# Altium project PCB_VideoMux.PrjPCB
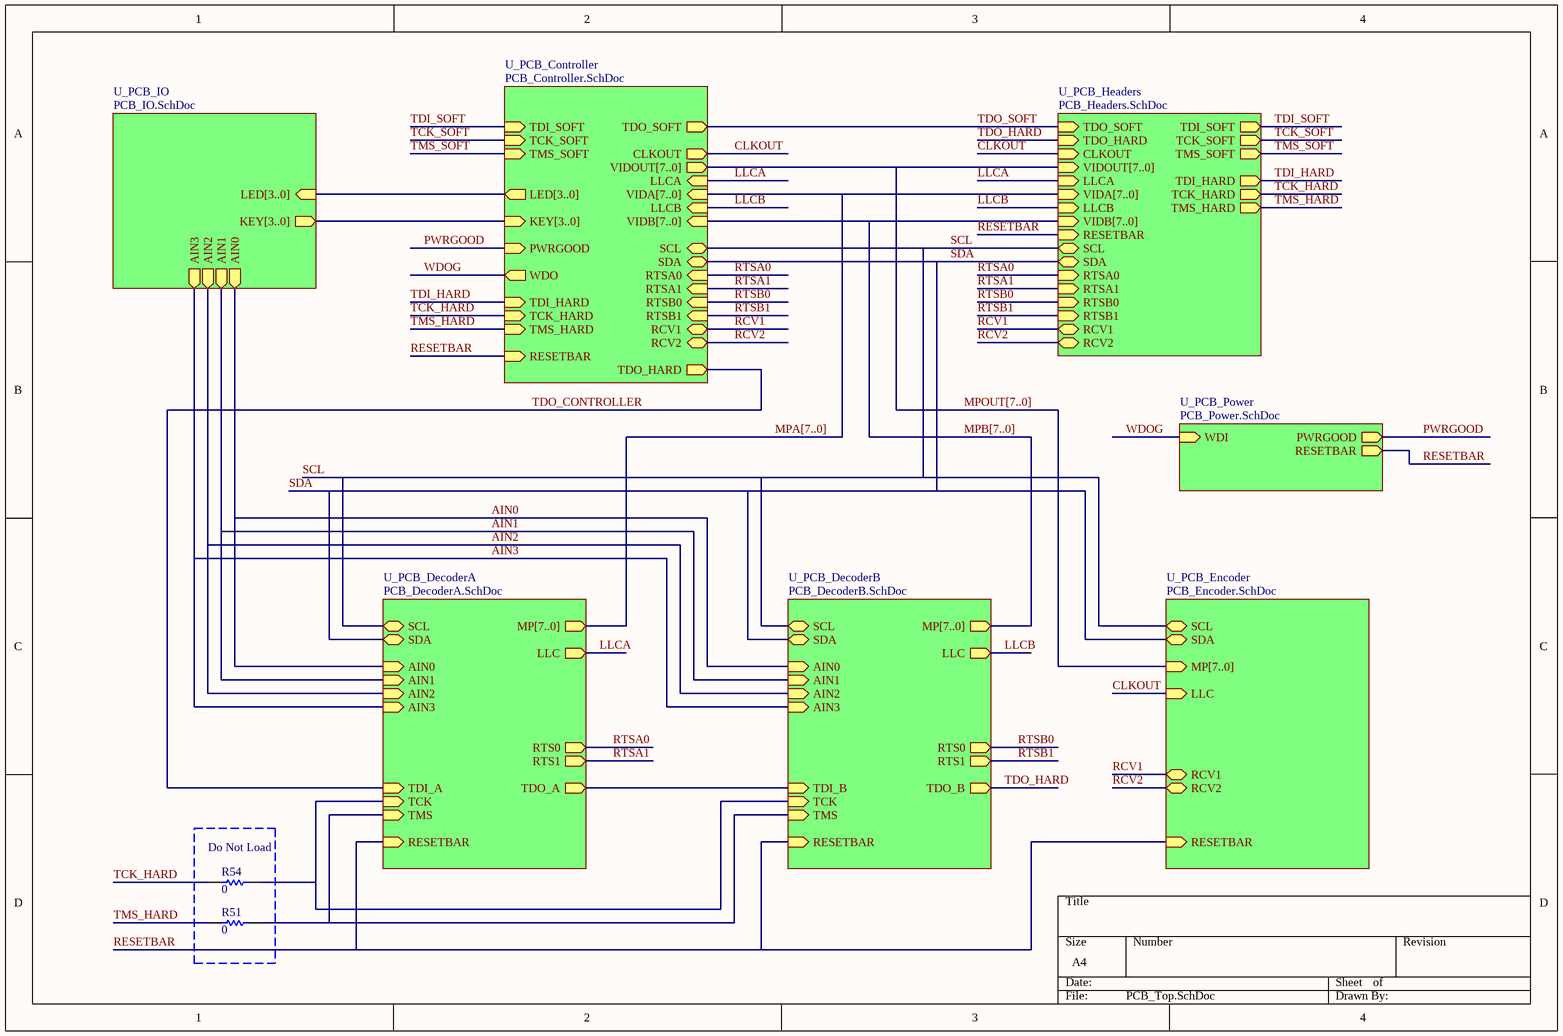
[diagram p0: PCB_Top.SchDoc]
8 sheets, 243 parts. Net scope: hierarchical (ports join the sheet entries above them; power ports are global).
Board file: VideoMuxBoard.PcbDoc
Sheets:
  PCB_Top.SchDoc
    U_PCB_DecoderA = PCB_DecoderA.SchDoc
    U_PCB_DecoderB = PCB_DecoderB.SchDoc
    U_PCB_Headers = PCB_Headers.SchDoc
    U_PCB_Encoder = PCB_Encoder.SchDoc
    U_PCB_IO = PCB_IO.SchDoc
    U_PCB_Controller = PCB_Controller.SchDoc
    U_PCB_Power = PCB_Power.SchDoc

## Sheet PCB_Top.SchDoc
size A4; DocumentNumber: 1; SheetNumber: 1; SheetTotal: 8

### Parts
R51  0  [CC2012-0805]
R54  0  [CC2012-0805]

### Blocks framed on the sheet
Do Not Load: R51 R54

### Sub-sheets
U_PCB_Controller = PCB_Controller.SchDoc: TMS_HARD (in), TMS_SOFT (in), TCK_SOFT (in), TDI_SOFT (in), TDI_HARD (in), TCK_HARD (in), TDO_HARD (out), TDO_SOFT (out), CLKOUT (out), VIDOUT[7..0] (out), LLCA (in), LLCB (in), VIDA[7..0] (in), VIDB[7..0] (in), RESETBAR (in), SCL (bidir), SDA (bidir), RTSA0 (in), RTSA1 (in), RTSB0 (in), RTSB1 (in), RCV1 (bidir), RCV2 (bidir), KEY[3..0] (in), LED[3..0] (out), PWRGOOD (in), WDO (out)
U_PCB_DecoderA = PCB_DecoderA.SchDoc: SCL (bidir), SDA (bidir), TDI_A (in), TCK (in), TMS (in), TDO_A (out), AIN0 (in), AIN1 (in), AIN2 (in), AIN3 (in), MP[7..0] (out), LLC (out), RESETBAR (in), RTS0 (out), RTS1 (out)
U_PCB_DecoderB = PCB_DecoderB.SchDoc: SCL (bidir), SDA (bidir), TDI_B (in), TCK (in), TMS (in), TDO_B (out), AIN0 (in), AIN1 (in), AIN2 (in), AIN3 (in), MP[7..0] (out), LLC (out), RESETBAR (in), RTS0 (out), RTS1 (out)
U_PCB_Encoder = PCB_Encoder.SchDoc: MP[7..0] (in), LLC (in), SCL (bidir), SDA (bidir), RESETBAR (in), RCV1 (bidir), RCV2 (bidir)
U_PCB_Headers = PCB_Headers.SchDoc: TMS_HARD (out), TMS_SOFT (out), TCK_SOFT (out), TDI_SOFT (out), TDI_HARD (out), TCK_HARD (out), TDO_HARD (in), TDO_SOFT (in), CLKOUT (in), VIDOUT[7..0] (in), LLCA (in), LLCB (in), VIDA[7..0] (in), VIDB[7..0] (in), RESETBAR (in), SCL (bidir), SDA (bidir), RTSA0 (in), RTSA1 (in), RTSB0 (in), RTSB1 (in), RCV1 (bidir), RCV2 (bidir)
U_PCB_IO = PCB_IO.SchDoc: AIN0 (out), AIN1 (out), AIN2 (out), AIN3 (out), KEY[3..0] (out), LED[3..0] (in)
U_PCB_Power = PCB_Power.SchDoc: PWRGOOD (out), RESETBAR (out), WDI (in)

### Nets
AIN0: sheet U_PCB_DecoderA/AIN0, sheet U_PCB_DecoderB/AIN0, sheet U_PCB_IO/AIN0
AIN1: sheet U_PCB_DecoderA/AIN1, sheet U_PCB_DecoderB/AIN1, sheet U_PCB_IO/AIN1
AIN2: sheet U_PCB_DecoderA/AIN2, sheet U_PCB_DecoderB/AIN2, sheet U_PCB_IO/AIN2
AIN3: sheet U_PCB_DecoderA/AIN3, sheet U_PCB_DecoderB/AIN3, sheet U_PCB_IO/AIN3
CLKOUT: sheet U_PCB_Headers/CLKOUT, sheet U_PCB_Encoder/LLC, sheet U_PCB_Controller/CLKOUT
LLCA: sheet U_PCB_DecoderA/LLC, sheet U_PCB_Headers/LLCA, sheet U_PCB_Controller/LLCA
LLCB: sheet U_PCB_DecoderB/LLC, sheet U_PCB_Headers/LLCB, sheet U_PCB_Controller/LLCB
PWRGOOD: sheet U_PCB_Controller/PWRGOOD, sheet U_PCB_Power/PWRGOOD
RCV1: sheet U_PCB_Headers/RCV1, sheet U_PCB_Encoder/RCV1, sheet U_PCB_Controller/RCV1
RCV2: sheet U_PCB_Headers/RCV2, sheet U_PCB_Encoder/RCV2, sheet U_PCB_Controller/RCV2
RESETBAR: sheet U_PCB_DecoderA/RESETBAR, sheet U_PCB_DecoderB/RESETBAR, sheet U_PCB_Headers/RESETBAR, sheet U_PCB_Encoder/RESETBAR, sheet U_PCB_Controller/RESETBAR, sheet U_PCB_Power/RESETBAR
RTSA0: sheet U_PCB_DecoderA/RTS0, sheet U_PCB_Headers/RTSA0, sheet U_PCB_Controller/RTSA0
RTSA1: sheet U_PCB_DecoderA/RTS1, sheet U_PCB_Headers/RTSA1, sheet U_PCB_Controller/RTSA1
RTSB0: sheet U_PCB_DecoderB/RTS0, sheet U_PCB_Headers/RTSB0, sheet U_PCB_Controller/RTSB0
RTSB1: sheet U_PCB_DecoderB/RTS1, sheet U_PCB_Headers/RTSB1, sheet U_PCB_Controller/RTSB1
SCL: sheet U_PCB_DecoderA/SCL, sheet U_PCB_DecoderB/SCL, sheet U_PCB_Headers/SCL, sheet U_PCB_Encoder/SCL, sheet U_PCB_Controller/SCL
SDA: sheet U_PCB_DecoderA/SDA, sheet U_PCB_DecoderB/SDA, sheet U_PCB_Headers/SDA, sheet U_PCB_Encoder/SDA, sheet U_PCB_Controller/SDA
TCK: R54.2 ; sheet U_PCB_DecoderA/TCK, sheet U_PCB_DecoderB/TCK
TCK_HARD: R54.1 ; sheet U_PCB_Headers/TCK_HARD, sheet U_PCB_Controller/TCK_HARD
TCK_SOFT: sheet U_PCB_Headers/TCK_SOFT, sheet U_PCB_Controller/TCK_SOFT
TDI_B: sheet U_PCB_DecoderA/TDO_A, sheet U_PCB_DecoderB/TDI_B
TDI_HARD: sheet U_PCB_Headers/TDI_HARD, sheet U_PCB_Controller/TDI_HARD
TDI_SOFT: sheet U_PCB_Headers/TDI_SOFT, sheet U_PCB_Controller/TDI_SOFT
TDO_CONTROLLER: sheet U_PCB_DecoderA/TDI_A, sheet U_PCB_Controller/TDO_HARD
TDO_HARD: sheet U_PCB_DecoderB/TDO_B, sheet U_PCB_Headers/TDO_HARD
TDO_SOFT: sheet U_PCB_Headers/TDO_SOFT, sheet U_PCB_Controller/TDO_SOFT
TMS: R51.2 ; sheet U_PCB_DecoderA/TMS, sheet U_PCB_DecoderB/TMS
TMS_HARD: R51.1 ; sheet U_PCB_Headers/TMS_HARD, sheet U_PCB_Controller/TMS_HARD
TMS_SOFT: sheet U_PCB_Headers/TMS_SOFT, sheet U_PCB_Controller/TMS_SOFT
WDOG: sheet U_PCB_Controller/WDO, sheet U_PCB_Power/WDI

### Buses and harness runs
bus MPA[7..0] = sheet U_PCB_Controller/VIDA[7..0] = sheet U_PCB_DecoderA/MP[7..0] = sheet U_PCB_Headers/VIDA[7..0]
bus MPB[7..0] = sheet U_PCB_Controller/VIDB[7..0] = sheet U_PCB_DecoderB/MP[7..0] = sheet U_PCB_Headers/VIDB[7..0]
bus MPOUT[7..0] = sheet U_PCB_Controller/VIDOUT[7..0] = sheet U_PCB_Encoder/MP[7..0] = sheet U_PCB_Headers/VIDOUT[7..0]
bus sheet U_PCB_Controller/KEY[3..0] = sheet U_PCB_IO/KEY[3..0]
bus sheet U_PCB_Controller/LED[3..0] = sheet U_PCB_IO/LED[3..0]

### Library data of the parts
R51 R54 = RES: Resistor; Fitted: True

## Sheet PCB_DecoderA.SchDoc
size A4; DocumentNumber: 3; SheetNumber: 3; SheetTotal: 8
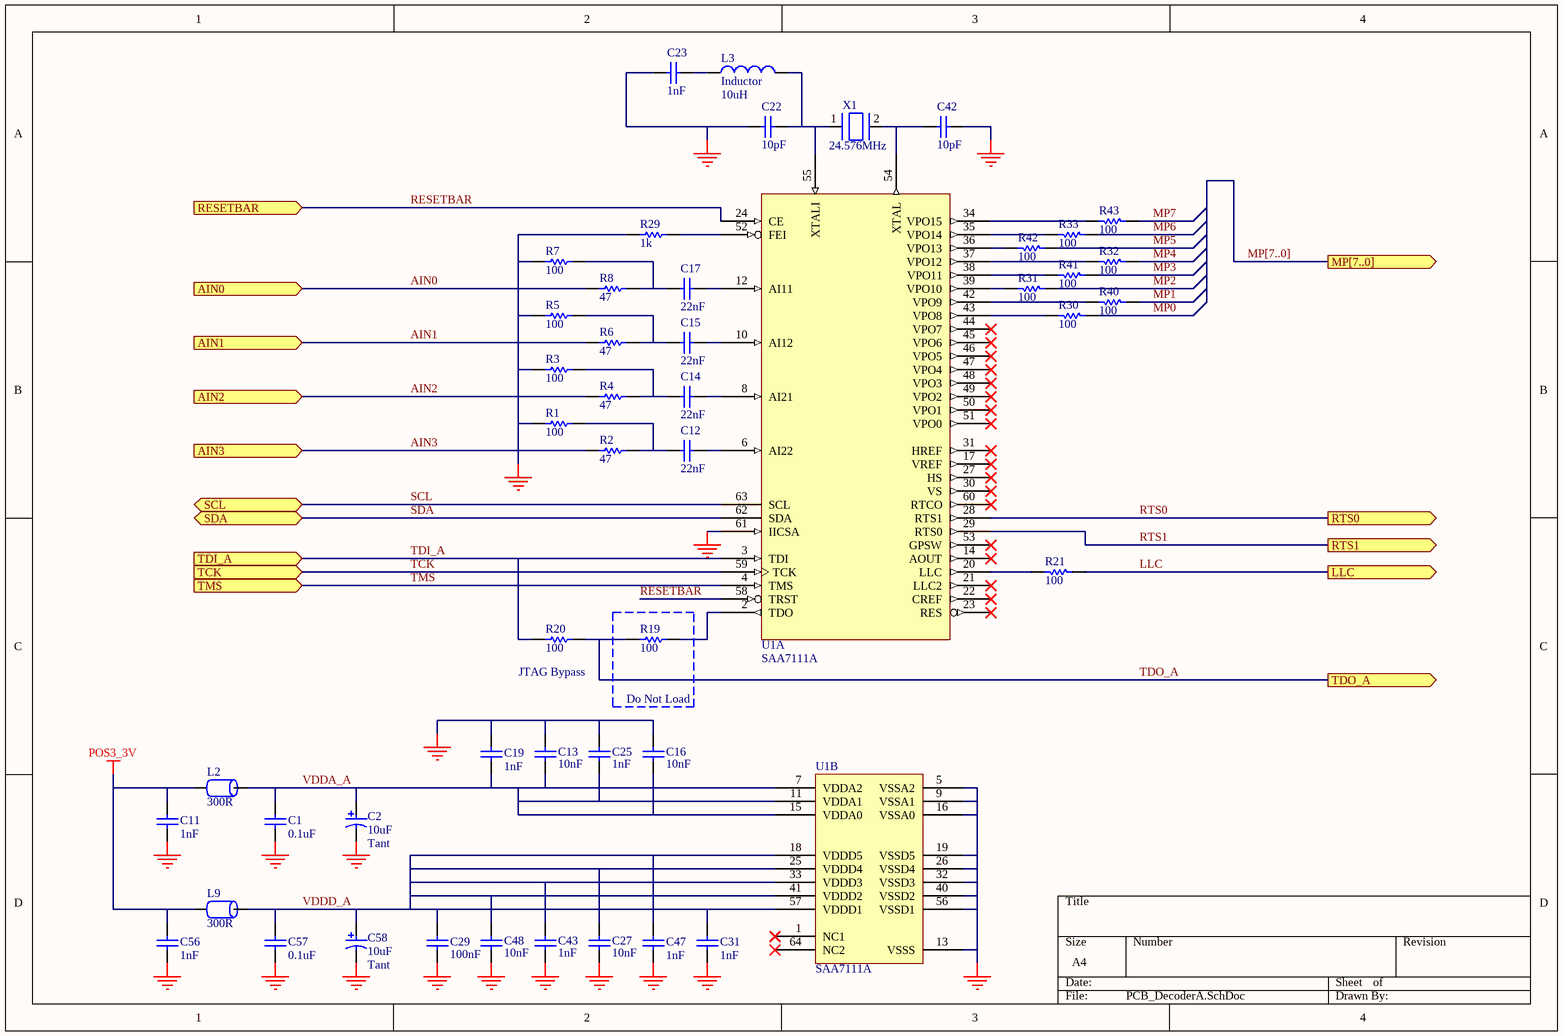
[diagram p1: PCB_DecoderA.SchDoc]

### Parts
C1  0.1uF  [CC2012-0805]
C2  10uF  Capacitor Type: Tant  [MCCT-B]
C11  1nF  [CC2012-0805]
C12  22nF  [CC2012-0805]
C13  10nF  [CC2012-0805]
C14  22nF  [CC2012-0805]
C15  22nF  [CC2012-0805]
C16  10nF  [CC2012-0805]
C17  22nF  [CC2012-0805]
C19  1nF  [CC2012-0805]
C22  10pF  [CC2012-0805]
C23  1nF  [CC2012-0805]
C25  1nF  [CC2012-0805]
C27  10nF  [CC2012-0805]
C29  100nF  [CC2012-0805]
C31  1nF  [CC2012-0805]
C42  10pF  [CC2012-0805]
C43  1nF  [CC2012-0805]
C47  1nF  [CC2012-0805]
C48  10nF  [CC2012-0805]
C56  1nF  [CC2012-0805]
C57  0.1uF  [CC2012-0805]
C58  10uF  Capacitor Type: Tant  [MCCT-B]
L2  300R  [CC2012-0805]
L3  Inductor  value 10uH  [SIMID1008-A]
L9  300R  [CC2012-0805]
R1  100  [CC2012-0805]
R2  47  [CC2012-0805]
R3  100  [CC2012-0805]
R4  47  [CC2012-0805]
R5  100  [CC2012-0805]
R6  47  [CC2012-0805]
R7  100  [CC2012-0805]
R8  47  [CC2012-0805]
R19  100  [CC2012-0805]
R20  100  [CC2012-0805]
R21  100  [CC2012-0805]
R29  1k  [CC2012-0805]
R30  100  [CC2012-0805]
R31  100  [CC2012-0805]
R32  100  [CC2012-0805]
R33  100  [CC2012-0805]
R40  100  [CC2012-0805]
R41  100  [CC2012-0805]
R42  100  [CC2012-0805]
R43  100  [CC2012-0805]
U1  SAA7111A  [QFP14X14_64]  (parts A,B of 2)
X1  24.576MHz  [QC49/SMD]

### Blocks framed on the sheet
Do Not Load: R19

### Ports
AIN0 (in), AIN1 (in), AIN2 (in), AIN3 (in), LLC (out), MP[7..0] (out), RESETBAR (in), RTS0 (out), RTS1 (out), SCL (bidir), SDA (bidir), TCK (in), TDI_A (in), TDO_A (out), TMS (in)

### Nets
GND: C1.2 C2.2 C11.2 C13.1 C16.1 C19.1 C22.1 C23.1 C25.1 C27.2 C29.2 C31.2 C42.2 C43.2 C47.2 C48.2 C56.2 C57.2 C58.2 R1.1 R3.1 R5.1 R7.1 R29.1 U1.5(VSSA2) U1.9(VSSA1) U1.13(VSSS) U1.16(VSSA0) U1.19(VSSD5) U1.26(VSSD4) U1.32(VSSD3) U1.40(VSSD2) U1.56(VSSD1) U1.61(IICSA)
POS3_3V: C11.1 C56.1 L2.1 L9.1
AIN0: R8.1 ; port AIN0
AIN1: R6.1 ; port AIN1
AIN2: R4.1 ; port AIN2
AIN3: R2.1 ; port AIN3
LLC: R21.1 ; port LLC  [project net LLCA]
MP0: R30.1  [project net MPA0]
MP1: R40.1  [project net MPA1]
MP2: R31.1  [project net MPA2]
MP3: R41.1  [project net MPA3]
MP4: R32.1  [project net MPA4]
MP5: R42.1  [project net MPA5]
MP6: R33.1  [project net MPA6]
MP7: R43.1  [project net MPA7]
RESETBAR: U1.24(CE) U1.58(TRST) ; port RESETBAR
RTS0: U1.28(RTS1) ; port RTS0  [project net RTSA0]
RTS1: U1.29(RTS0) ; port RTS1  [project net RTSA1]
SCL: U1.63(SCL) ; port SCL
SDA: U1.62(SDA) ; port SDA
TCK: U1.59(TCK) ; port TCK
TDI_A: R20.1 U1.3(TDI) ; port TDI_A  [project net TDO_CONTROLLER]
TDO_A: R19.1 R20.2 ; port TDO_A  [project net TDI_B]
TMS: U1.4(TMS) ; port TMS
VDDA_A: C1.1 C2.1 C13.2 C16.2 C19.2 C25.2 L2.2 U1.7(VDDA2) U1.11(VDDA1) U1.15(VDDA0)
VDDD_A: C27.1 C29.1 C31.1 C43.1 C47.1 C48.1 C57.1 C58.1 L9.2 U1.18(VDDD5) U1.25(VDDD4) U1.33(VDDD3) U1.41(VDDD2) U1.57(VDDD1)
NetC12_1: C12.1 R1.2 R2.2
NetC12_2: C12.2 U1.6(AI22)
NetC14_1: C14.1 R3.2 R4.2
NetC14_2: C14.2 U1.8(AI21)
NetC15_1: C15.1 R5.2 R6.2
NetC15_2: C15.2 U1.10(AI12)
NetC17_1: C17.1 R7.2 R8.2
NetC17_2: C17.2 U1.12(AI11)
NetC22_2: C22.2 L3.2 U1.55(XTALI) X1.1
NetC23_2: C23.2 L3.1
NetC42_1: C42.1 U1.54(XTAL) X1.2
NetR19_2: R19.2 U1.2(TDO)
NetR21_2: R21.2 U1.20(LLC)
NetR29_2: R29.2 U1.52(FEI)
NetR30_2: R30.2 U1.43(VPO8)
NetR31_2: R31.2 U1.39(VPO10)
NetR32_2: R32.2 U1.37(VPO12)
NetR33_2: R33.2 U1.35(VPO14)
NetR40_2: R40.2 U1.42(VPO9)
NetR41_2: R41.2 U1.38(VPO11)
NetR42_2: R42.2 U1.36(VPO13)
NetR43_2: R43.2 U1.34(VPO15)

Not connected (* = marked no-connect by the designer): U1 1(NC1)* 14(AOUT)* 17(VREF)* 21(LLC2)* 22(CREF)* 23(RES)* 27(HS)* 30(VS)* 31(HREF)* 44(VPO7)* 45(VPO6)* 46(VPO5)* 47(VPO4)* 48(VPO3)* 49(VPO2)* 50(VPO1)* 51(VPO0)* 53(GPSW)* 60(RTCO)* 64(NC2)*

### Buses and harness runs
bus MP[7..0] = port MP[7..0]

### Notes on the sheet
- (near R20) JTAG Bypass

### Library data of the parts
C1 C11-C17 C19 C22 C23 C25 C27 C29 C31 C42 C43 C47 C48 C56 C57 = CAP: Capacitor; Fitted: True
C2 C58 = CAP_POLAR: Polar Capacitor; Fitted: True
L2 L9 = FERRITE_BEAD: BMB Series Ferrite Chip Bead
L3 = Inductor: Manufacturer: Generic Components; Class I: Passive; Published: 8-Jun-2000; Revision: July-2002: Re-released for DXP Platform.; Publisher: Altium Limited; Class II: Inductor
R1-R8 R19-R21 R29-R33 R40-R43 = RES: Resistor; Fitted: True
U1 = SAA7111A: Philips Enhanced Video Input Processor
X1 = CRYSTAL

## Sheet PCB_DecoderB.SchDoc
size A4; DocumentNumber: 4; SheetNumber: 4; SheetTotal: 8
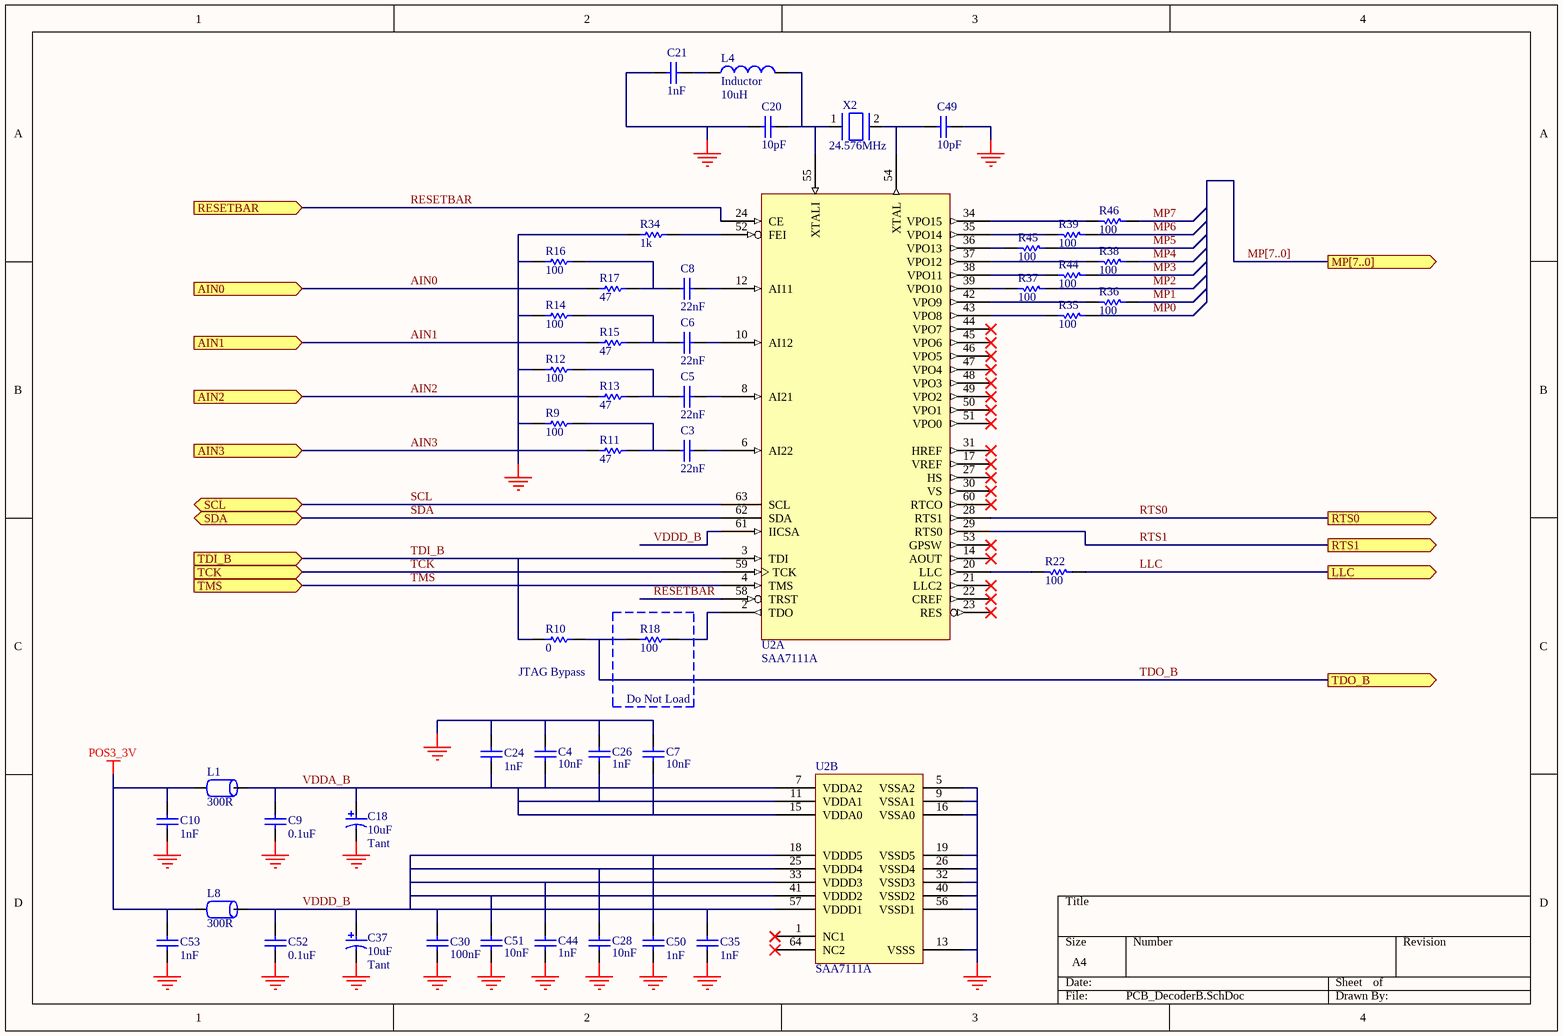
[diagram p2: PCB_DecoderB.SchDoc]

### Parts
C3  22nF  [CC2012-0805]
C4  10nF  [CC2012-0805]
C5  22nF  [CC2012-0805]
C6  22nF  [CC2012-0805]
C7  10nF  [CC2012-0805]
C8  22nF  [CC2012-0805]
C9  0.1uF  [CC2012-0805]
C10  1nF  [CC2012-0805]
C18  10uF  Capacitor Type: Tant  [MCCT-B]
C20  10pF  [CC2012-0805]
C21  1nF  [CC2012-0805]
C24  1nF  [CC2012-0805]
C26  1nF  [CC2012-0805]
C28  10nF  [CC2012-0805]
C30  100nF  [CC2012-0805]
C35  1nF  [CC2012-0805]
C37  10uF  Capacitor Type: Tant  [MCCT-B]
C44  1nF  [CC2012-0805]
C49  10pF  [CC2012-0805]
C50  1nF  [CC2012-0805]
C51  10nF  [CC2012-0805]
C52  0.1uF  [CC2012-0805]
C53  1nF  [CC2012-0805]
L1  300R  [CC2012-0805]
L4  Inductor  value 10uH  [SIMID1008-A]
L8  300R  [CC2012-0805]
R9  100  [CC2012-0805]
R10  0  [CC2012-0805]
R11  47  [CC2012-0805]
R12  100  [CC2012-0805]
R13  47  [CC2012-0805]
R14  100  [CC2012-0805]
R15  47  [CC2012-0805]
R16  100  [CC2012-0805]
R17  47  [CC2012-0805]
R18  100  [CC2012-0805]
R22  100  [CC2012-0805]
R34  1k  [CC2012-0805]
R35  100  [CC2012-0805]
R36  100  [CC2012-0805]
R37  100  [CC2012-0805]
R38  100  [CC2012-0805]
R39  100  [CC2012-0805]
R44  100  [CC2012-0805]
R45  100  [CC2012-0805]
R46  100  [CC2012-0805]
U2  SAA7111A  [QFP14X14_64]  (parts A,B of 2)
X2  24.576MHz  [QC49/SMD]

### Blocks framed on the sheet
Do Not Load: R18

### Ports
AIN0 (in), AIN1 (in), AIN2 (in), AIN3 (in), LLC (out), MP[7..0] (out), RESETBAR (in), RTS0 (out), RTS1 (out), SCL (bidir), SDA (bidir), TCK (in), TDI_B (in), TDO_B (out), TMS (in)

### Nets
GND: C4.1 C7.1 C9.2 C10.2 C18.2 C20.1 C21.1 C24.1 C26.1 C28.2 C30.2 C35.2 C37.2 C44.2 C49.2 C50.2 C51.2 C52.2 C53.2 R9.1 R12.1 R14.1 R16.1 R34.1 U2.5(VSSA2) U2.9(VSSA1) U2.13(VSSS) U2.16(VSSA0) U2.19(VSSD5) U2.26(VSSD4) U2.32(VSSD3) U2.40(VSSD2) U2.56(VSSD1)
POS3_3V: C10.1 C53.1 L1.1 L8.1
AIN0: R17.1 ; port AIN0
AIN1: R15.1 ; port AIN1
AIN2: R13.1 ; port AIN2
AIN3: R11.1 ; port AIN3
LLC: R22.1 ; port LLC  [project net LLCB]
MP0: R35.1  [project net MPB0]
MP1: R36.1  [project net MPB1]
MP2: R37.1  [project net MPB2]
MP3: R44.1  [project net MPB3]
MP4: R38.1  [project net MPB4]
MP5: R45.1  [project net MPB5]
MP6: R39.1  [project net MPB6]
MP7: R46.1  [project net MPB7]
RESETBAR: U2.24(CE) U2.58(TRST) ; port RESETBAR
RTS0: U2.28(RTS1) ; port RTS0  [project net RTSB0]
RTS1: U2.29(RTS0) ; port RTS1  [project net RTSB1]
SCL: U2.63(SCL) ; port SCL
SDA: U2.62(SDA) ; port SDA
TCK: U2.59(TCK) ; port TCK
TDI_B: R10.1 U2.3(TDI) ; port TDI_B
TDO_B: R10.2 R18.1 ; port TDO_B  [project net TDO_HARD]
TMS: U2.4(TMS) ; port TMS
VDDA_B: C4.2 C7.2 C9.1 C18.1 C24.2 C26.2 L1.2 U2.7(VDDA2) U2.11(VDDA1) U2.15(VDDA0)
VDDD_B: C28.1 C30.1 C35.1 C37.1 C44.1 C50.1 C51.1 C52.1 L8.2 U2.18(VDDD5) U2.25(VDDD4) U2.33(VDDD3) U2.41(VDDD2) U2.57(VDDD1) U2.61(IICSA)
NetC3_1: C3.1 R9.2 R11.2
NetC3_2: C3.2 U2.6(AI22)
NetC5_1: C5.1 R12.2 R13.2
NetC5_2: C5.2 U2.8(AI21)
NetC6_1: C6.1 R14.2 R15.2
NetC6_2: C6.2 U2.10(AI12)
NetC8_1: C8.1 R16.2 R17.2
NetC8_2: C8.2 U2.12(AI11)
NetC20_2: C20.2 L4.2 U2.55(XTALI) X2.1
NetC21_2: C21.2 L4.1
NetC49_1: C49.1 U2.54(XTAL) X2.2
NetR18_2: R18.2 U2.2(TDO)
NetR22_2: R22.2 U2.20(LLC)
NetR34_2: R34.2 U2.52(FEI)
NetR35_2: R35.2 U2.43(VPO8)
NetR36_2: R36.2 U2.42(VPO9)
NetR37_2: R37.2 U2.39(VPO10)
NetR38_2: R38.2 U2.37(VPO12)
NetR39_2: R39.2 U2.35(VPO14)
NetR44_2: R44.2 U2.38(VPO11)
NetR45_2: R45.2 U2.36(VPO13)
NetR46_2: R46.2 U2.34(VPO15)

Not connected (* = marked no-connect by the designer): U2 1(NC1)* 14(AOUT)* 17(VREF)* 21(LLC2)* 22(CREF)* 23(RES)* 27(HS)* 30(VS)* 31(HREF)* 44(VPO7)* 45(VPO6)* 46(VPO5)* 47(VPO4)* 48(VPO3)* 49(VPO2)* 50(VPO1)* 51(VPO0)* 53(GPSW)* 60(RTCO)* 64(NC2)*

### Buses and harness runs
bus MP[7..0] = port MP[7..0]

### Notes on the sheet
- (near R10) JTAG Bypass

### Library data of the parts
C3-C10 C20 C21 C24 C26 C28 C30 C35 C44 C49-C53 = CAP: Capacitor; Fitted: True
C18 C37 = CAP_POLAR: Polar Capacitor; Fitted: True
L1 L8 = FERRITE_BEAD: BMB Series Ferrite Chip Bead
L4 = Inductor: as L3 on sheet PCB_DecoderA; Published: 8-Jun-2000; Revision: July-2002: Re-released for DXP Platform.; Publisher: Altium Limited; Class II: Inductor
R9-R18 R22 R34-R39 R44-R46 = RES: Resistor; Fitted: True
U2 = SAA7111A: Philips Enhanced Video Input Processor
X2 = CRYSTAL

## Sheet PCB_Headers.SchDoc
size A4; DocumentNumber: 6; SheetNumber: 6; SheetTotal: 8
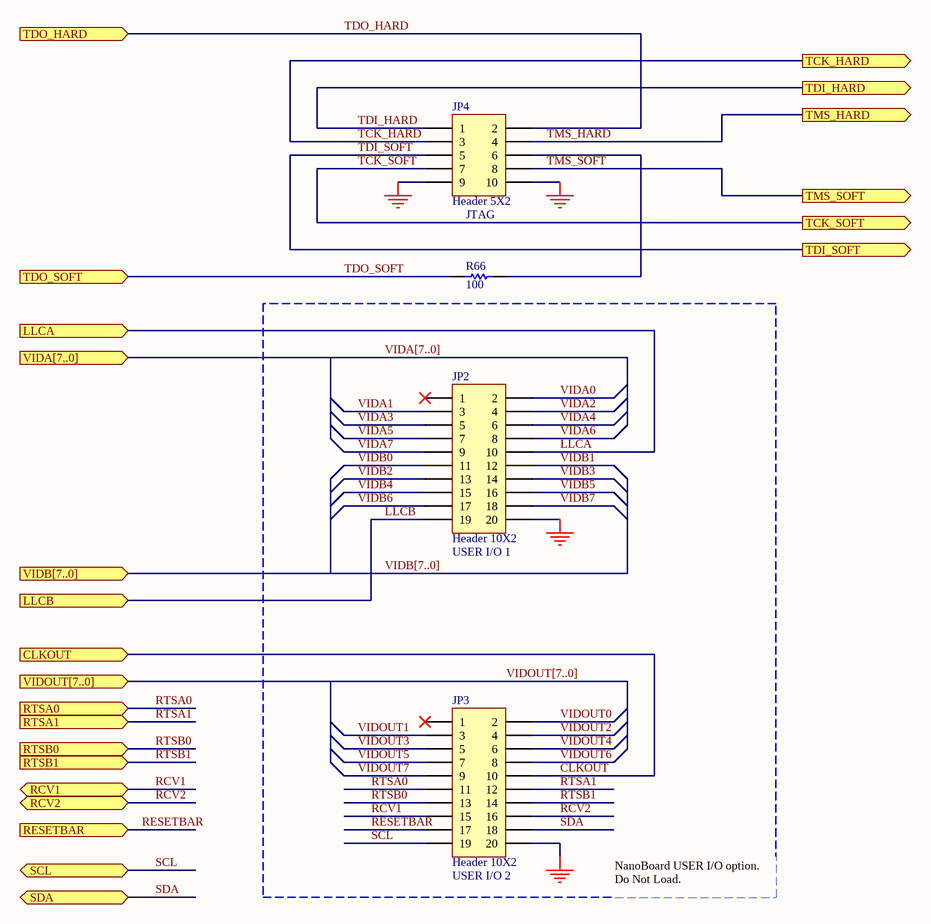
[diagram p3: PCB_Headers.SchDoc]

### Parts
JP2  Header 10X2  [HDR2X10]
JP3  Header 10X2  [HDR2X10]
JP4  Header 5X2  [HDR2X5]
R66  100  [CC2012-0805]

### Ports
CLKOUT (in), LLCA (in), LLCB (in), RCV1 (bidir), RCV2 (bidir), RESETBAR (in), RTSA0 (in), RTSA1 (in), RTSB0 (in), RTSB1 (in), SCL (bidir), SDA (bidir), TCK_HARD (out), TCK_SOFT (out), TDI_HARD (out), TDI_SOFT (out), TDO_HARD (in), TDO_SOFT (in), TMS_HARD (out), TMS_SOFT (out), VIDA[7..0] (in), VIDB[7..0] (in), VIDOUT[7..0] (in)

### Nets
GND: JP2.20 JP3.20 JP4.9 JP4.10
CLKOUT: JP3.10 ; port CLKOUT
LLCA: JP2.10 ; port LLCA
LLCB: JP2.19 ; port LLCB
RCV1: JP3.15 ; port RCV1
RCV2: JP3.16 ; port RCV2
RESETBAR: JP3.17 ; port RESETBAR
RTSA0: JP3.11 ; port RTSA0
RTSA1: JP3.12 ; port RTSA1
RTSB0: JP3.13 ; port RTSB0
RTSB1: JP3.14 ; port RTSB1
SCL: JP3.19 ; port SCL
SDA: JP3.18 ; port SDA
TCK_HARD: JP4.3 ; port TCK_HARD
TCK_SOFT: JP4.7 ; port TCK_SOFT
TDI_HARD: JP4.1 ; port TDI_HARD
TDI_SOFT: JP4.5 ; port TDI_SOFT
TDO_HARD: JP4.2 ; port TDO_HARD
TDO_SOFT: R66.1 ; port TDO_SOFT
TMS_HARD: JP4.4 ; port TMS_HARD
TMS_SOFT: JP4.8 ; port TMS_SOFT
VIDA0: JP2.2  [project net MPA0]
VIDA1: JP2.3  [project net MPA1]
VIDA2: JP2.4  [project net MPA2]
VIDA3: JP2.5  [project net MPA3]
VIDA4: JP2.6  [project net MPA4]
VIDA5: JP2.7  [project net MPA5]
VIDA6: JP2.8  [project net MPA6]
VIDA7: JP2.9  [project net MPA7]
VIDB0: JP2.11  [project net MPB0]
VIDB1: JP2.12  [project net MPB1]
VIDB2: JP2.13  [project net MPB2]
VIDB3: JP2.14  [project net MPB3]
VIDB4: JP2.15  [project net MPB4]
VIDB5: JP2.16  [project net MPB5]
VIDB6: JP2.17  [project net MPB6]
VIDB7: JP2.18  [project net MPB7]
VIDOUT0: JP3.2  [project net MPOUT0]
VIDOUT1: JP3.3  [project net MPOUT1]
VIDOUT2: JP3.4  [project net MPOUT2]
VIDOUT3: JP3.5  [project net MPOUT3]
VIDOUT4: JP3.6  [project net MPOUT4]
VIDOUT5: JP3.7  [project net MPOUT5]
VIDOUT6: JP3.8  [project net MPOUT6]
VIDOUT7: JP3.9  [project net MPOUT7]
NetJP4_6: JP4.6 R66.2

Not connected (* = marked no-connect by the designer): JP2 1*; JP3 1*

### Buses and harness runs
bus VIDA[7..0] = port VIDA[7..0]
bus VIDB[7..0] = port VIDB[7..0]
bus VIDOUT[7..0] = port VIDOUT[7..0]

### Notes on the sheet
- (near JP4) JTAG
- (near JP2) USER I/O 1
- (near JP3) USER I/O 2
- NanoBoard USER I/O option. Do Not Load.

### Library data of the parts
JP2 JP3 = Header 10X2: Header, 10-Pin, Dual row; Manufacturer: Generic Components; Class I: Connector; Revision: July-2002: Re-released for DXP Platform.; Publisher: Altium Limited
JP4 = Header 5X2: Header, 5-Pin, Dual row; Manufacturer: Generic Components; Class I: Connector; Revision: July-2002: Re-released for DXP Platform.; Publisher: Altium Limited
R66 = RES: Resistor; Fitted: True

## Sheet PCB_Encoder.SchDoc
size A4; DocumentNumber: 2; SheetNumber: 2; SheetTotal: 8
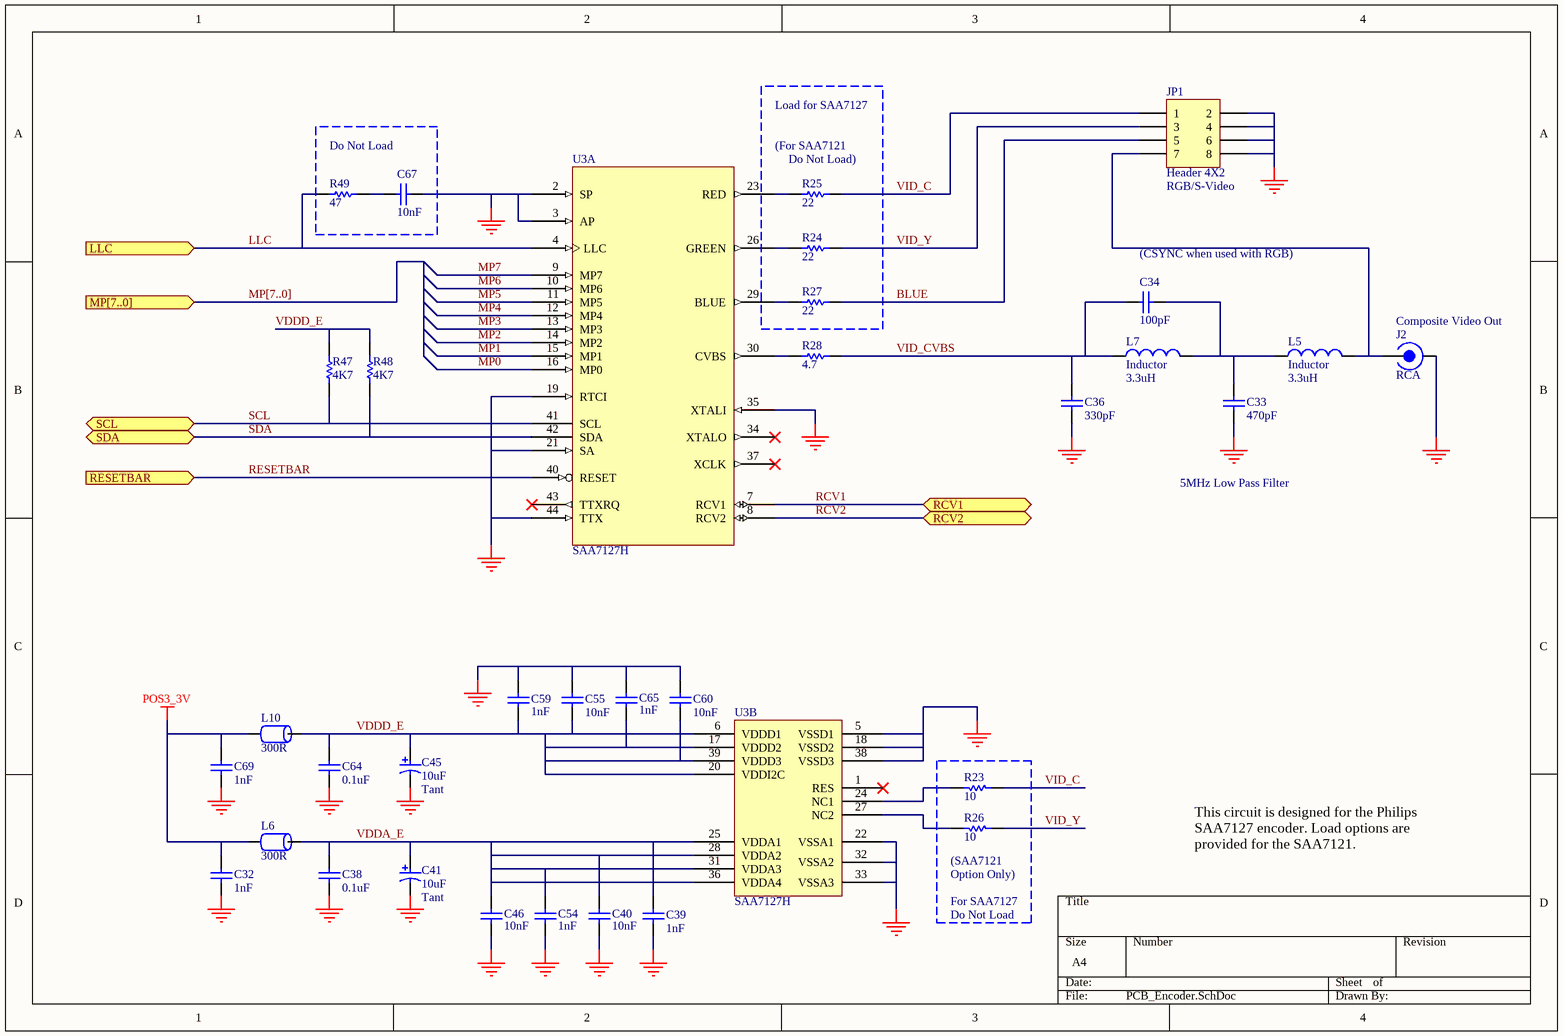
[diagram p4: PCB_Encoder.SchDoc]

### Parts
C32  1nF  [CC2012-0805]
C33  470pF  [CC2012-0805]
C34  100pF  [CC2012-0805]
C36  330pF  [CC2012-0805]
C38  0.1uF  [CC2012-0805]
C39  1nF  [CC2012-0805]
C40  10nF  [CC2012-0805]
C41  10uF  Capacitor Type: Tant  [MCCT-B]
C45  10uF  Capacitor Type: Tant  [MCCT-B]
C46  10nF  [CC2012-0805]
C54  1nF  [CC2012-0805]
C55  10nF  [CC2012-0805]
C59  1nF  [CC2012-0805]
C60  10nF  [CC2012-0805]
C64  0.1uF  [CC2012-0805]
C65  1nF  [CC2012-0805]
C67  10nF  [CC2012-0805]
C69  1nF  [CC2012-0805]
J2  RCA  [RCA_MR551L]
JP1  Header 4X2  [HDR2X4]
L5  Inductor  value 3.3uH  [CC2012-0805]
L6  300R  [CC2012-0805]
L7  Inductor  value 3.3uH  [CC2012-0805]
L10  300R  [CC2012-0805]
R23  10  [CC2012-0805]
R24  22  [CC2012-0805]
R25  22  [CC2012-0805]
R26  10  [CC2012-0805]
R27  22  [CC2012-0805]
R28  4.7  [CC2012-0805]
R47  4K7  [CC2012-0805]
R48  4K7  [CC2012-0805]
R49  47  [CC2012-0805]
U3  SAA7127H  [QFP10X10_44]  (parts A,B of 2)

### Blocks framed on the sheet
Do Not Load: C67 R49

### Ports
LLC (in), MP[7..0] (in), RCV1 (bidir), RCV2 (bidir), RESETBAR (in), SCL (bidir), SDA (bidir)

### Nets
GND: C32.2 C33.2 C36.2 C38.2 C39.2 C40.2 C41.2 C45.2 C46.2 C54.2 C55.1 C59.1 C60.1 C64.2 C65.1 C67.2 C69.2 J2.2 JP1.2 JP1.4 JP1.6 JP1.8 U3.2(SP) U3.3(AP) U3.5(VSSD1) U3.18(VSSD2) U3.19(RTCI) U3.21(SA) U3.22(VSSA1) U3.32(VSSA2) U3.33(VSSA3) U3.35(XTALI) U3.38(VSSD3) U3.44(TTX)
POS3_3V: C32.1 C69.1 L6.1 L10.1
BLUE: JP1.5 R27.2
LLC: R49.1 U3.4(LLC) ; port LLC  [project net CLKOUT]
MP0: U3.16(MP0)  [project net MPOUT0]
MP1: U3.15(MP1)  [project net MPOUT1]
MP2: U3.14(MP2)  [project net MPOUT2]
MP3: U3.13(MP3)  [project net MPOUT3]
MP4: U3.12(MP4)  [project net MPOUT4]
MP5: U3.11(MP5)  [project net MPOUT5]
MP6: U3.10(MP6)  [project net MPOUT6]
MP7: U3.9(MP7)  [project net MPOUT7]
RCV1: U3.7(RCV1) ; port RCV1
RCV2: U3.8(RCV2) ; port RCV2
RESETBAR: U3.40(RESET) ; port RESETBAR
SCL: R47.1 U3.41(SCL) ; port SCL
SDA: R48.1 U3.42(SDA) ; port SDA
VDDA_E: C38.1 C39.1 C40.1 C41.1 C46.1 C54.1 L6.2 U3.25(VDDA1) U3.28(VDDA2) U3.31(VDDA3) U3.36(VDDA4)
VDDD_E: C45.1 C55.2 C59.2 C60.2 C64.1 C65.2 L10.2 R47.2 R48.2 U3.6(VDDD1) U3.17(VDDD2) U3.20(VDDI2C) U3.39(VDDD3)
VID_C: JP1.1 R23.2 R25.2
VID_CVBS: C34.1 C36.1 L7.1 R28.2
VID_Y: JP1.3 R24.2 R26.2
NetC33_1: C33.1 C34.2 L5.1 L7.2
NetC67_1: C67.1 R49.2
NetJ2_1: J2.1 JP1.7 L5.2
NetR23_1: R23.1 U3.24(NC1)
NetR24_1: R24.1 U3.26(GREEN)
NetR25_1: R25.1 U3.23(RED)
NetR26_1: R26.1 U3.27(NC2)
NetR27_1: R27.1 U3.29(BLUE)
NetR28_1: R28.1 U3.30(CVBS)

Not connected (* = marked no-connect by the designer): U3 1(RES)* 34(XTALO)* 37(XCLK)* 43(TTXRQ)*

### Buses and harness runs
bus MP[7..0] = port MP[7..0]

### Notes on the sheet
- Load for SAA7127
- (For SAA7121
- (near R25) Do Not Load)
- (near JP1) RGB/S-Video
- (near C34) (CSYNC when used with RGB)
- (near J2) Composite Video Out
- 5MHz Low Pass Filter
- (near R26) (SAA7121
- (near R26) Option Only)
- For SAA7127
- Do Not Load
- This circuit is designed for the Philips SAA7127 encoder. Load options are provided for the SAA7121.

### Library data of the parts
C32-C34 C36 C38-C40 C46 C54 C55 C59 C60 C64 C65 C67 C69 = CAP: Capacitor; Fitted: True
C41 C45 = CAP_POLAR: Polar Capacitor; Fitted: True
J2 = RCA: RCA Socket
JP1 = Header 4X2: Header, 4-Pin, Dual row; Manufacturer: Generic Components; Class I: Connector; Revision: July-2002: Re-released for DXP Platform.; Publisher: Altium Limited
L5 L7 = Inductor: as L3 on sheet PCB_DecoderA; Published: 8-Jun-2000; Revision: July-2002: Re-released for DXP Platform.; Publisher: Altium Limited; Class II: Inductor
L6 L10 = FERRITE_BEAD: BMB Series Ferrite Chip Bead
R23-R28 R47-R49 = RES: Resistor; Fitted: True
U3 = SAA7127H: Philips Digital Video Encoder

## Sheet PCB_IO.SchDoc
size A4; DocumentNumber: 7; SheetNumber: 7; SheetTotal: 8
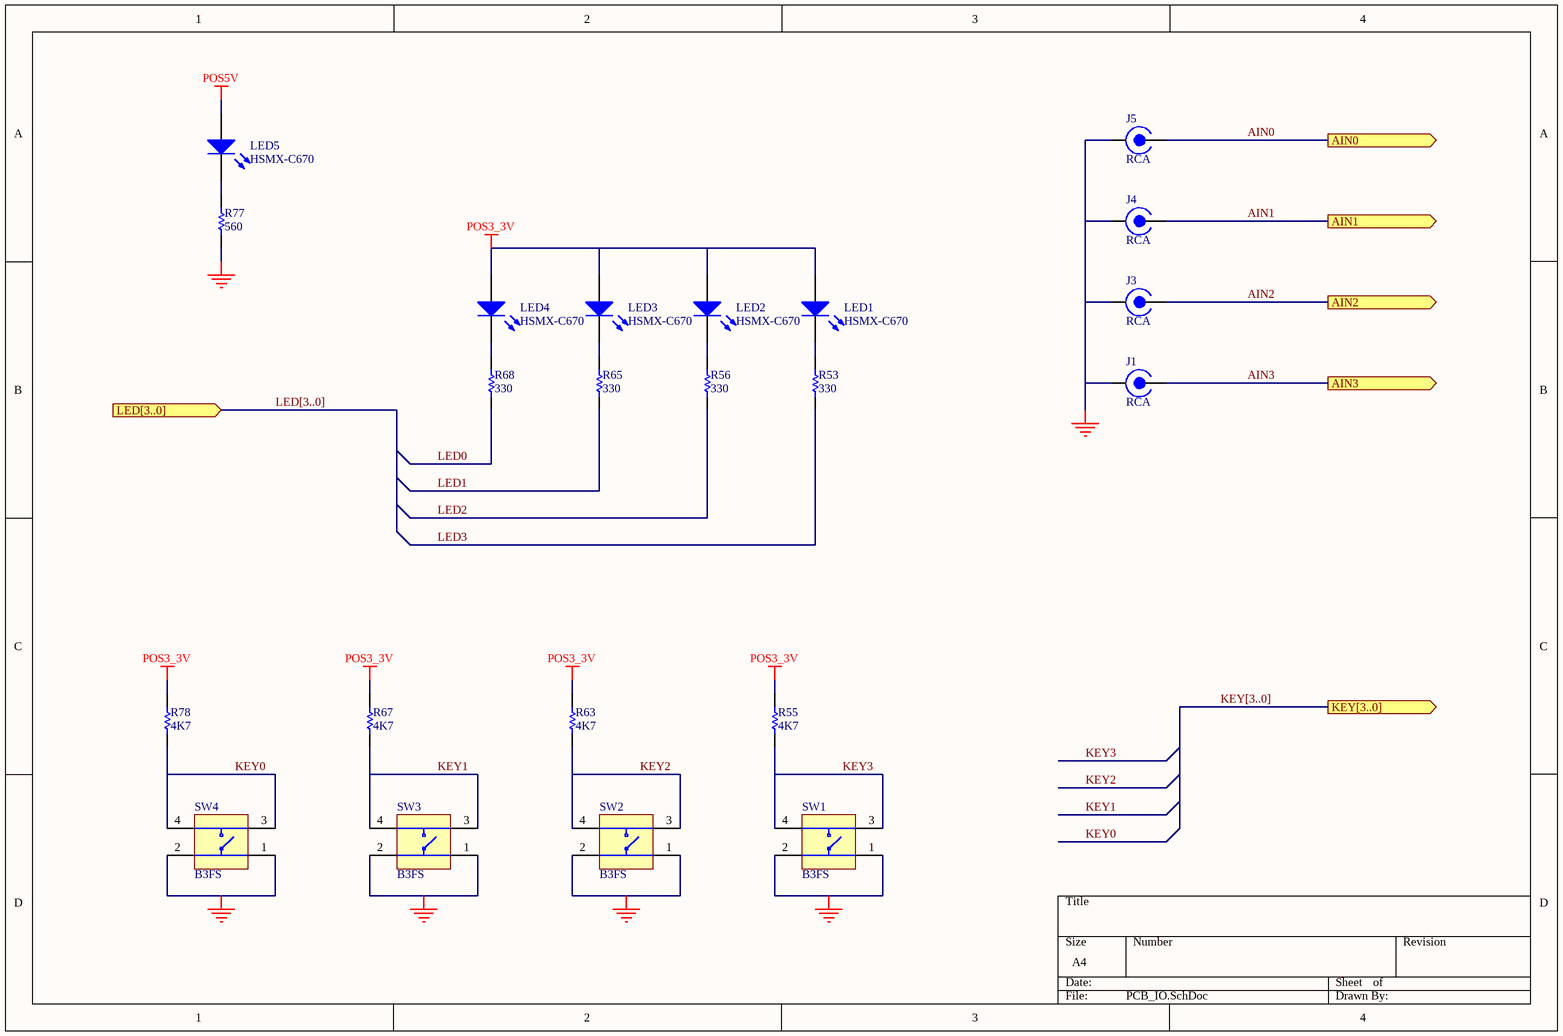
[diagram p5: PCB_IO.SchDoc]

### Parts
J1  RCA  [RCA_MR551L]
J3  RCA  [RCA_MR551L]
J4  RCA  [RCA_MR551L]
J5  RCA  [RCA_MR551L]
LED1  HSMX-C670  [SMD _LED]
LED2  HSMX-C670  [SMD _LED]
LED3  HSMX-C670  [SMD _LED]
LED4  HSMX-C670  [SMD _LED]
LED5  HSMX-C670  [SMD _LED]
R53  330  [CC2012-0805]
R55  4K7  [CC2012-0805]
R56  330  [CC2012-0805]
R63  4K7  [CC2012-0805]
R65  330  [CC2012-0805]
R67  4K7  [CC2012-0805]
R68  330  [CC2012-0805]
R77  560  [CC2012-0805]
R78  4K7  [CC2012-0805]
SW1  B3FS  [B3FS_SWITCH]
SW2  B3FS  [B3FS_SWITCH]
SW3  B3FS  [B3FS_SWITCH]
SW4  B3FS  [B3FS_SWITCH]

### Ports
AIN0 (out), AIN1 (out), AIN2 (out), AIN3 (out), KEY[3..0] (out), LED[3..0] (in)

### Nets
GND: J1.2 J3.2 J4.2 J5.2 R77.2 SW1.1 SW1.2 SW2.1 SW2.2 SW3.1 SW3.2 SW4.1 SW4.2
POS3_3V: LED1.1(A) LED2.1(A) LED3.1(A) LED4.1(A) R55.1 R63.1 R67.1 R78.1
POS5V: LED5.1(A)
AIN0: J5.1 ; port AIN0
AIN1: J4.1 ; port AIN1
AIN2: J3.1 ; port AIN2
AIN3: J1.1 ; port AIN3
KEY0: R78.2 SW4.3 SW4.4
KEY1: R67.2 SW3.3 SW3.4
KEY2: R63.2 SW2.3 SW2.4
KEY3: R55.2 SW1.3 SW1.4
LED0: R68.2
LED1: R65.2
LED2: R56.2
LED3: R53.2
NetLED1_2: LED1.2(K) R53.1
NetLED2_2: LED2.2(K) R56.1
NetLED3_2: LED3.2(K) R65.1
NetLED4_2: LED4.2(K) R68.1
NetLED5_2: LED5.2(K) R77.1

### Buses and harness runs
bus KEY[3..0] = port KEY[3..0]
bus LED[3..0] = port LED[3..0]

### Library data of the parts
J1 J3-J5 = RCA: RCA Socket
LED1-LED5 = HSMX-C670: Typical RED GaAs SMD LED Agilent make; Manufacturer: Generic Components; Class I: Optoelectronic; Fitted: True; Published: 8-Jun-2000; Revision: July-2002: Re-released for DXP Platform.; Publisher: Altium Limited; Class II: LED
R53 R55 R56 R63 R65 R67 R68 R77 R78 = RES: Resistor; Fitted: True
SW1-SW4 = B3FS: SPNA SMD Keyboard Switch; Fitted: True; Comment_1: B3FS

## Sheet PCB_Controller.SchDoc
size A3; DocumentNumber: 8; SheetNumber: 8; SheetTotal: 8
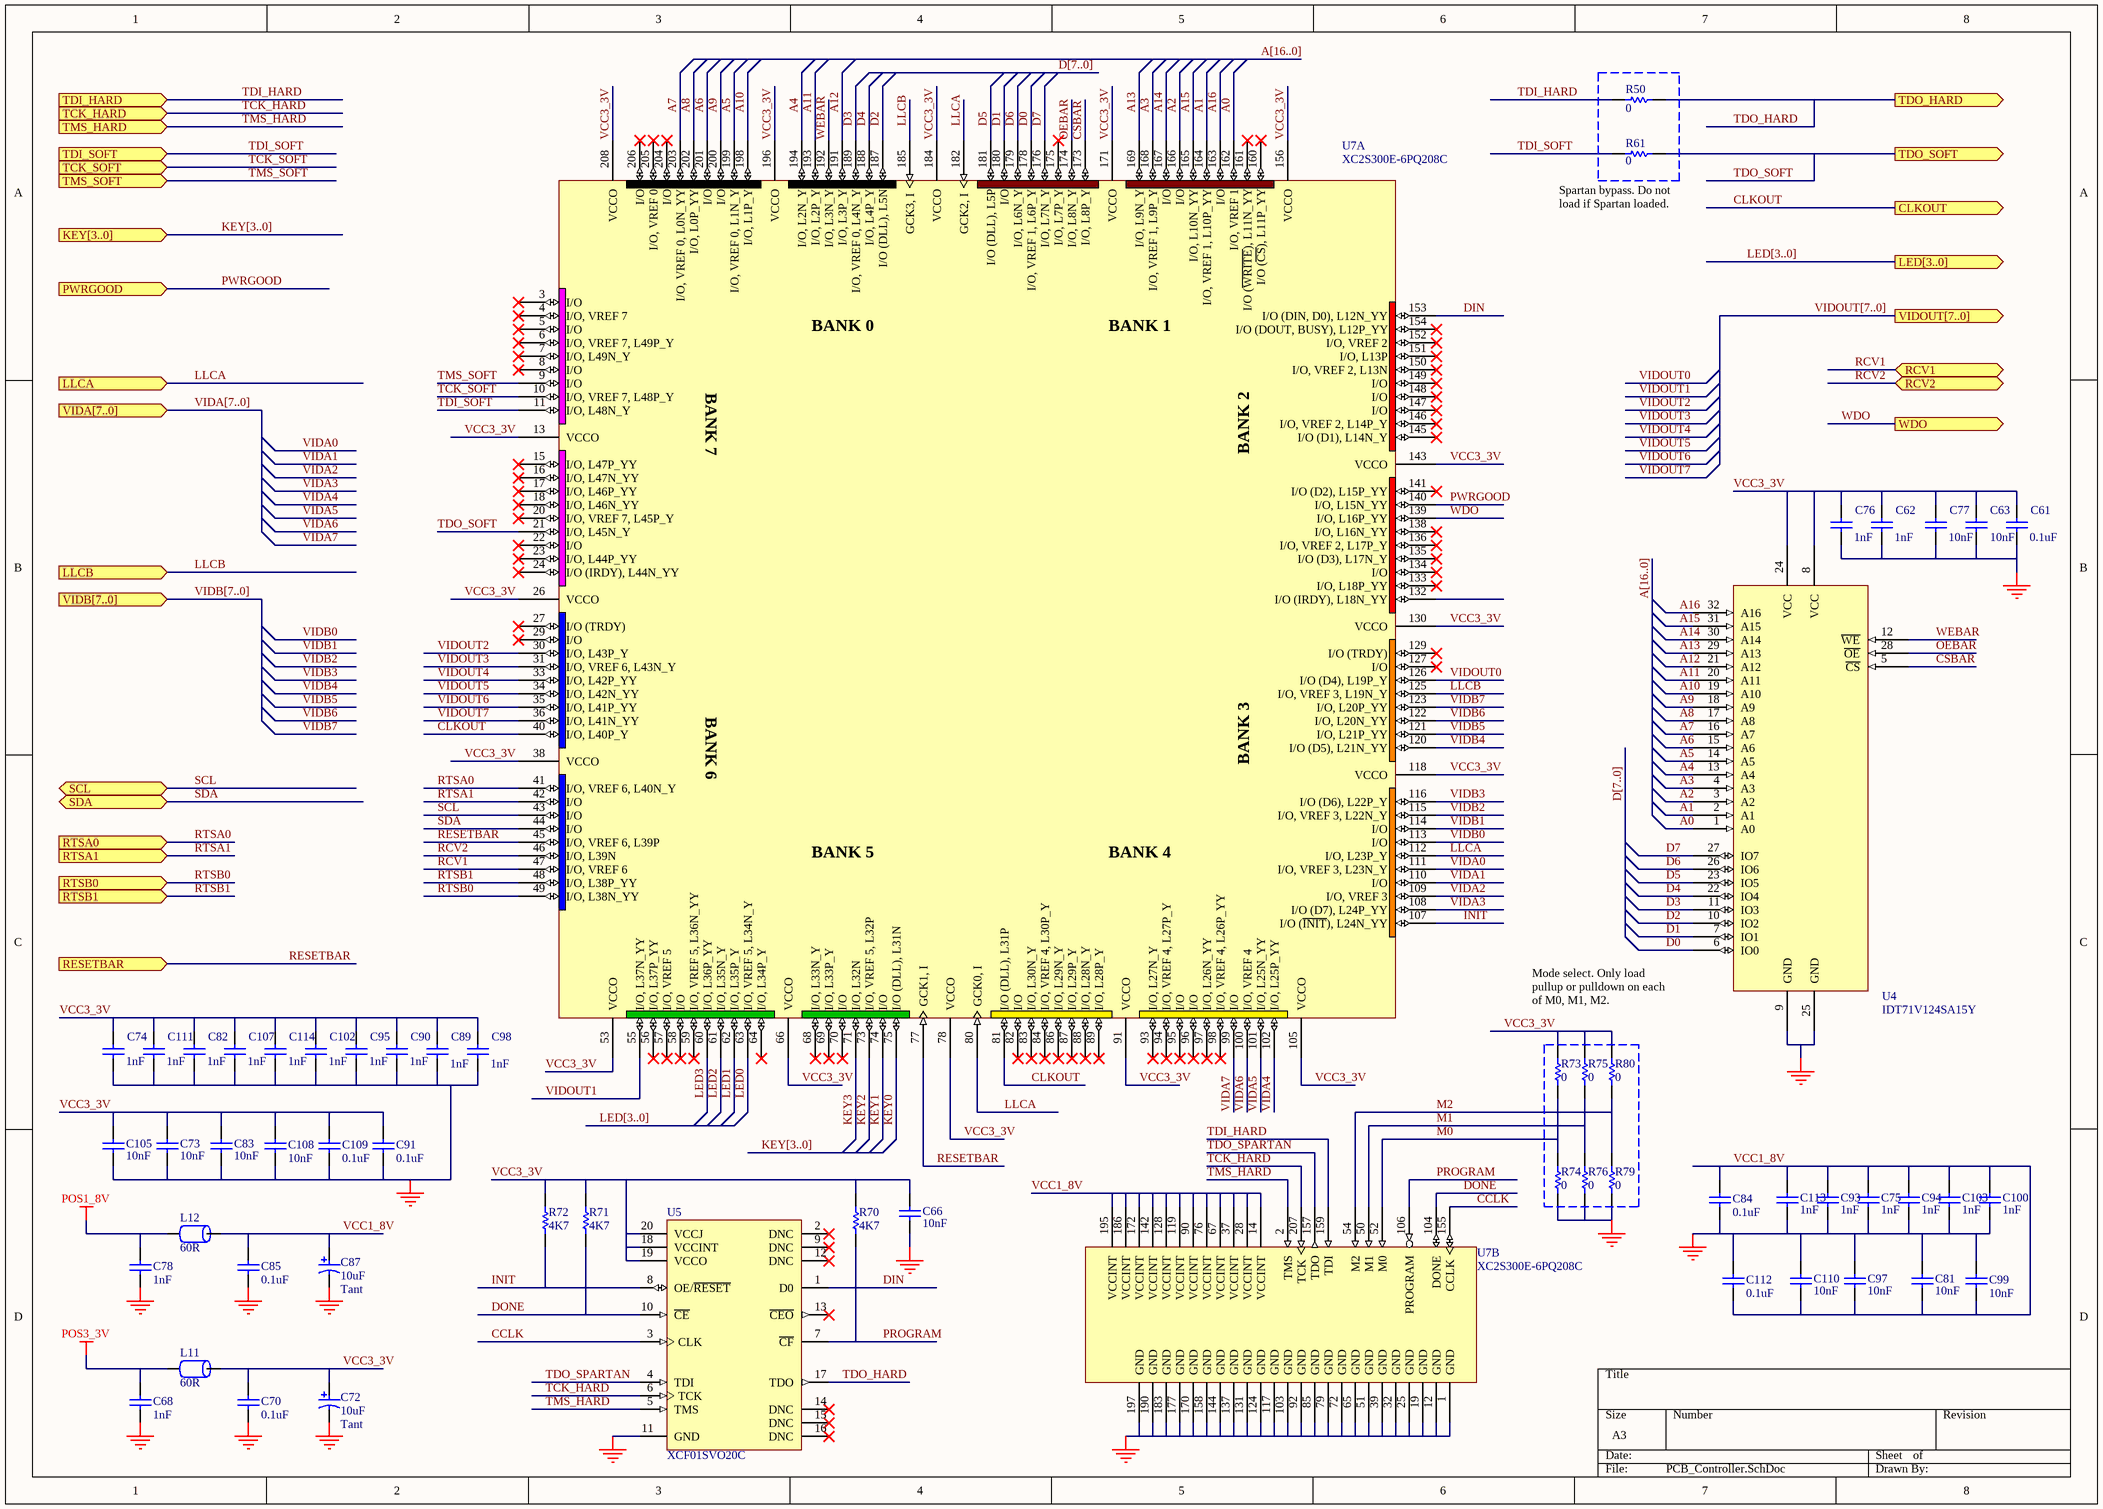
[diagram p6: PCB_Controller.SchDoc]

### Parts
C61  0.1uF  [CC2012-0805]
C62  1nF  [CC2012-0805]
C63  10nF  [CC2012-0805]
C66  10nF  [CC2012-0805]
C68  1nF  [CC2012-0805]
C70  0.1uF  [CC2012-0805]
C72  10uF  Capacitor Type: Tant  [MCCT-B]
C73  10nF  [CC2012-0805]
C74  1nF  [CC2012-0805]
C75  1nF  [CC2012-0805]
C76  1nF  [CC2012-0805]
C77  10nF  [CC2012-0805]
C78  1nF  [CC2012-0805]
C81  10nF  [CC2012-0805]
C82  1nF  [CC2012-0805]
C83  10nF  [CC2012-0805]
C84  0.1uF  [CC2012-0805]
C85  0.1uF  [CC2012-0805]
C87  10uF  Capacitor Type: Tant  [MCCT-B]
C89  1nF  [CC2012-0805]
C90  1nF  [CC2012-0805]
C91  0.1uF  [CC2012-0805]
C93  1nF  [CC2012-0805]
C94  1nF  [CC2012-0805]
C95  1nF  [CC2012-0805]
C97  10nF  [CC2012-0805]
C98  1nF  [CC2012-0805]
C99  10nF  [CC2012-0805]
C100  1nF  [CC2012-0805]
C102  1nF  [CC2012-0805]
C103  1nF  [CC2012-0805]
C105  10nF  [CC2012-0805]
C107  1nF  [CC2012-0805]
C108  10nF  [CC2012-0805]
C109  0.1uF  [CC2012-0805]
C110  10nF  [CC2012-0805]
C111  1nF  [CC2012-0805]
C112  0.1uF  [CC2012-0805]
C113  1nF  [CC2012-0805]
C114  1nF  [CC2012-0805]
L11  60R  [CC2012-0805]
L12  60R  [CC2012-0805]
R50  0  [CC2012-0805]
R61  0  [CC2012-0805]
R70  4K7  [CC2012-0805]
R71  4K7  [CC2012-0805]
R72  4K7  [CC2012-0805]
R73  0  [CC2012-0805]
R74  0  [CC2012-0805]
R75  0  [CC2012-0805]
R76  0  [CC2012-0805]
R79  0  [CC2012-0805]
R80  0  [CC2012-0805]
U4  IDT71V124SA15Y  [SO-J32]
U5  XCF01SVO20C  [VO20]
U7  XC2S300E-6PQ208C  [F-QFP28X28-G208/P.5N]  (parts A,B of 2)

### Ports
CLKOUT (out), KEY[3..0] (in), LED[3..0] (out), LLCA (in), LLCB (in), PWRGOOD (in), RCV1 (bidir), RCV2 (bidir), RESETBAR (in), RTSA0 (in), RTSA1 (in), RTSB0 (in), RTSB1 (in), SCL (bidir), SDA (bidir), TCK_HARD (in), TCK_SOFT (in), TDI_HARD (in), TDI_SOFT (in), TDO_HARD (out), TDO_SOFT (out), TMS_HARD (in), TMS_SOFT (in), VIDA[7..0] (in), VIDB[7..0] (in), VIDOUT[7..0] (out), WDO (out)

### Nets
GND: C61.2 C62.2 C63.2 C66.2 C68.2 C70.2 C72.2 C73.2 C74.2 C75.2 C76.2 C77.2 C78.2 C81.1 C82.2 C83.2 C84.2 C85.2 C87.2 C89.2 C90.2 C91.2 C93.2 C94.2 C95.2 C97.1 C98.2 C99.1 C100.2 C102.2 C103.2 C105.2 C107.2 C108.2 C109.2 C110.1 C111.2 C112.1 C113.2 C114.2 R74.2 R76.2 R79.2 U4.9(GND) U4.25(GND) U5.11(GND) U7.1(GND) U7.12(GND) U7.19(GND) U7.25(GND) U7.32(GND) U7.39(GND) U7.51(GND) U7.65(GND) U7.72(GND) U7.79(GND) U7.85(GND) U7.92(GND) U7.103(GND) U7.117(GND) U7.124(GND) U7.131(GND) U7.137(GND) U7.144(GND) U7.158(GND) U7.170(GND) U7.177(GND) U7.183(GND) U7.190(GND) U7.197(GND)
POS1_8V: C78.1 L12.1
POS3_3V: C68.1 L11.1
A0: U4.1(A0) U7.162(I/O,_VREF_1)
A1: U4.2(A1) U7.164(I/O,_VREF_1,_L10P_YY)
A2: U4.3(A2) U7.166(I/O)
A3: U4.4(A3) U7.168(I/O,_VREF_1,_L9P_Y)
A4: U4.13(A4) U7.194(I/O,_L2N_Y)
A5: U4.14(A5) U7.199(I/O,_VREF_0,_L1N_Y)
A6: U4.15(A6) U7.201(I/O)
A7: U4.16(A7) U7.203(I/O,_VREF_0,_L0N_YY)
A8: U4.17(A8) U7.202(I/O,_L0P_YY)
A9: U4.18(A9) U7.200(I/O)
A10: U4.19(A10) U7.198(I/O,_L1P_Y)
A11: U4.20(A11) U7.193(I/O,_L2P_Y)
A12: U4.21(A12) U7.191(I/O,_L3P_Y)
A13: U4.29(A13) U7.169(I/O,_L9N_Y)
A14: U4.30(A14) U7.167(I/O)
A15: U4.31(A15) U7.165(I/O,_L10N_YY)
A16: U4.32(A16) U7.163(I/O)
CCLK: U5.3(CLK) U7.155(CCLK)
CLKOUT: U7.40(I/O,_L40P_Y) U7.81(I/O_(DLL),_L31P) ; port CLKOUT
CSBAR: U4.5(~{CS}) U7.173(I/O,_L8P_Y)
D0: U4.6(IO0) U7.178(I/O,_VREF_1,_L6P_Y)
D1: U4.7(IO1) U7.180(I/O)
D2: U4.10(IO2) U7.187(I/O_(DLL),_L5N)
D3: U4.11(IO3) U7.189(I/O,_VREF_0,_L4N_Y)
D4: U4.22(IO4) U7.188(I/O,_L4P_Y)
D5: U4.23(IO5) U7.181(I/O_(DLL),_L5P)
D6: U4.26(IO6) U7.179(I/O,_L6N_Y)
D7: U4.27(IO7) U7.176(I/O,_L7N_Y)
DIN: U5.1(D0) U7.153(I/O_(DIN,_D0),_L12N_YY)
DONE: R71.2 U5.10(~{CE}) U7.104(DONE)
INIT: R72.2 U5.8(OE/~{RESET}) U7.107(I/O_(~{INIT}),_L24N_YY)
KEY0: U7.75(I/O_(DLL),_L31N)
KEY1: U7.74(I/O)
KEY2: U7.73(I/O,_VREF_5,_L32P)
KEY3: U7.71(I/O,_L32N)
LED0: U7.63(I/O,_VREF_5,_L34N_Y)
LED1: U7.62(I/O,_L35P_Y)
LED2: U7.61(I/O,_L35N_Y)
LED3: U7.60(I/O,_L36P_YY)
LLCA: U7.80(GCK0,_I) U7.112(I/O,_L23P_Y) U7.182(GCK2,_I) ; port LLCA
LLCB: U7.125(I/O,_VREF_3,_L19N_Y) U7.185(GCK3,_I) ; port LLCB
M0: R73.2 R74.1 U7.52(M0)
M1: R75.2 R76.1 U7.50(M1)
M2: R79.1 R80.2 U7.54(M2)
OEBAR: U4.28(~{OE}) U7.174(I/O,_L8N_Y)
PROGRAM: R70.2 U5.7(~{CF}) U7.106(PROGRAM)
PWRGOOD: U7.140(I/O,_L15N_YY) ; port PWRGOOD
RCV1: U7.47(I/O,_VREF_6) ; port RCV1
RCV2: U7.46(I/O,_L39N) ; port RCV2
RESETBAR: U7.45(I/O,_VREF_6,_L39P) U7.77(GCK1,_I) ; port RESETBAR
RTSA0: U7.41(I/O,_VREF_6,_L40N_Y) ; port RTSA0
RTSA1: U7.42(I/O) ; port RTSA1
RTSB0: U7.49(I/O,_L38N_YY) ; port RTSB0
RTSB1: U7.48(I/O,_L38P_YY) ; port RTSB1
SCL: U7.43(I/O) ; port SCL
SDA: U7.44(I/O) ; port SDA
TCK_HARD: U5.6(TCK) U7.207(TCK) ; port TCK_HARD
TCK_SOFT: U7.10(I/O,_VREF_7,_L48P_Y) ; port TCK_SOFT
TDI_HARD: R50.1 U7.159(TDI) ; port TDI_HARD
TDI_SOFT: R61.1 U7.11(I/O,_L48N_Y) ; port TDI_SOFT
TDO_HARD: R50.2 U5.17(TDO) ; port TDO_HARD  [project net TDO_CONTROLLER]
TDO_SOFT: R61.2 U7.21(I/O,_L45N_Y) ; port TDO_SOFT
TDO_SPARTAN: U5.4(TDI) U7.157(TDO)
TMS_HARD: U5.5(TMS) U7.2(TMS) ; port TMS_HARD
TMS_SOFT: U7.9(I/O) ; port TMS_SOFT
VCC1_8V: C75.1 C81.2 C84.1 C85.1 C87.1 C93.1 C94.1 C97.2 C99.2 C100.1 C103.1 C110.2 C112.2 C113.1 L12.2 U7.14(VCCINT) U7.28(VCCINT) U7.37(VCCINT) U7.67(VCCINT) U7.76(VCCINT) U7.90(VCCINT) U7.119(VCCINT) U7.128(VCCINT) U7.142(VCCINT) U7.172(VCCINT) U7.186(VCCINT) U7.195(VCCINT)
VCC3_3V: C61.1 C62.1 C63.1 C66.1 C70.1 C72.1 C73.1 C74.1 C76.1 C77.1 C82.1 C83.1 C89.1 C90.1 C91.1 C95.1 C98.1 C102.1 C105.1 C107.1 C108.1 C109.1 C111.1 C114.1 L11.2 R70.1 R71.1 R72.1 R73.1 R75.1 R80.1 U4.8(VCC) U4.24(VCC) U5.18(VCCINT) U5.19(VCCO) U5.20(VCCJ) U7.13(VCCO) U7.26(VCCO) U7.38(VCCO) U7.53(VCCO) U7.66(VCCO) U7.78(VCCO) U7.91(VCCO) U7.105(VCCO) U7.118(VCCO) U7.130(VCCO) U7.143(VCCO) U7.156(VCCO) U7.171(VCCO) U7.184(VCCO) U7.196(VCCO) U7.208(VCCO)
VIDA0: U7.111(I/O,_VREF_3,_L23N_Y)  [project net MPA0]
VIDA1: U7.110(I/O)  [project net MPA1]
VIDA2: U7.109(I/O,_VREF_3)  [project net MPA2]
VIDA3: U7.108(I/O_(D7),_L24P_YY)  [project net MPA3]
VIDA4: U7.102(I/O,_L25P_YY)  [project net MPA4]
VIDA5: U7.101(I/O,_L25N_YY)  [project net MPA5]
VIDA6: U7.100(I/O,_VREF_4)  [project net MPA6]
VIDA7: U7.99(I/O)  [project net MPA7]
VIDB0: U7.113(I/O)  [project net MPB0]
VIDB1: U7.114(I/O)  [project net MPB1]
VIDB2: U7.115(I/O,_VREF_3,_L22N_Y)  [project net MPB2]
VIDB3: U7.116(I/O_(D6),_L22P_Y)  [project net MPB3]
VIDB4: U7.120(I/O_(D5),_L21N_YY)  [project net MPB4]
VIDB5: U7.121(I/O,_L21P_YY)  [project net MPB5]
VIDB6: U7.122(I/O,_L20N_YY)  [project net MPB6]
VIDB7: U7.123(I/O,_L20P_YY)  [project net MPB7]
VIDOUT0: U7.126(I/O_(D4),_L19P_Y)  [project net MPOUT0]
VIDOUT1: U7.55(I/O,_L37N_YY)  [project net MPOUT1]
VIDOUT2: U7.30(I/O,_L43P_Y)  [project net MPOUT2]
VIDOUT3: U7.31(I/O,_VREF_6,_L43N_Y)  [project net MPOUT3]
VIDOUT4: U7.33(I/O,_L42P_YY)  [project net MPOUT4]
VIDOUT5: U7.34(I/O,_L42N_YY)  [project net MPOUT5]
VIDOUT6: U7.35(I/O,_L41P_YY)  [project net MPOUT6]
VIDOUT7: U7.36(I/O,_L41N_YY)  [project net MPOUT7]
WDO: U7.139(I/O,_L16P_YY) ; port WDO  [project net WDOG]
WEBAR: U4.12(~{WE}) U7.192(I/O,_L3N_Y)

Not connected (* = marked no-connect by the designer): U5 2(DNC)* 9(DNC)* 12(DNC)* 13(~{CEO})* 14(DNC)* 15(DNC)* 16(DNC)*; U7 3(I/O)* 4(I/O,_VREF_7)* 5(I/O)* 6(I/O,_VREF_7,_L49P_Y)* 7(I/O,_L49N_Y)* 8(I/O)* 15(I/O,_L47P_YY)* 16(I/O,_L47N_YY)* 17(I/O,_L46P_YY)* 18(I/O,_L46N_YY)* 20(I/O,_VREF_7,_L45P_Y)* 22(I/O)* 23(I/O,_L44P_YY)* 24(I/O_(IRDY),_L44N_YY)* 27(I/O_(TRDY))* 29(I/O)* 56(I/O,_L37P_YY)* 57(I/O,_VREF_5)* 58(I/O)* 59(I/O,_VREF_5,_L36N_YY)* 64(I/O,_L34P_Y)* 68(I/O,_L33N_Y)* 69(I/O,_L33P_Y)* 70(I/O)* 82(I/O)* 83(I/O,_L30N_Y)* 84(I/O,_VREF_4,_L30P_Y)* 86(I/O,_L29N_Y)* 87(I/O,_L29P_Y)* 88(I/O,_L28N_Y)* 89(I/O,_L28P_Y)* 93(I/O,_L27N_Y)* 94(I/O,_VREF_4,_L27P_Y)* 95(I/O)* 96(I/O)* 97(I/O,_L26N_YY)* 98(I/O,_VREF_4,_L26P_YY)* 127(I/O)* 129(I/O_(TRDY))* 132(I/O_(IRDY),_L18N_YY) 133(I/O,_L18P_YY)* 134(I/O)* 135(I/O_(D3),_L17N_Y)* 136(I/O,_VREF_2,_L17P_Y)* 138(I/O,_L16N_YY)* 141(I/O_(D2),_L15P_YY)* 145(I/O_(D1),_L14N_Y)* 146(I/O,_VREF_2,_L14P_Y)* 147(I/O)* 148(I/O)* 149(I/O)* 150(I/O,_VREF_2,_L13N)* 151(I/O,_L13P)* 152(I/O,_VREF_2)* 154(I/O_(DOUT,_BUSY),_L12P_YY)* 160(I/O_(~{CS}),_L11P_YY)* 161(I/O_(~{WRITE}),_L11N_YY)* 175(I/O,_L7P_Y)* 204(I/O)* 205(I/O,_VREF_0)* 206(I/O)*

### Buses and harness runs
bus A[16..0]
bus D[7..0]
bus KEY[3..0]
bus KEY[3..0] = port KEY[3..0]
bus LED[3..0]
bus LED[3..0] = port LED[3..0]
bus VIDA[7..0] = port VIDA[7..0]
bus VIDB[7..0] = port VIDB[7..0]
bus VIDOUT[7..0] = port VIDOUT[7..0]

### Notes on the sheet
- (near R61) Spartan bypass. Do not load if Spartan loaded.
- Mode select. Only load pullup or pulldown on each of M0, M1, M2.
- (in symbol XC2S300E-6PQ208C, part A) BANK 0; BANK 1; BANK 7; BANK 2; BANK 6; BANK 3; BANK 5; BANK 4

### Library data of the parts
C61-C63 C66 C68 C70 C73-C78 C81-C85 C89-C91 C93-C95 C97-C100 C102 C103 C105 C107-C114 = CAP: Capacitor; Fitted: True
C72 C87 = CAP_POLAR: Polar Capacitor; Fitted: True
L11 L12 = FERRITE_BEAD: BMB Series Ferrite Chip Bead
R50 R61 R70-R76 R79 R80 = RES: Resistor; Fitted: True
U4 = IDT71V124SA15Y: 128K x 8 bit Fast Static RAM; Fitted: True; Supplier: IDT
U5 = XCF01SVO20C: XCF00S Series, Platform Flash In-System Programmable Configuration 3.3V PROM, 1-Megabit, Commercial Grade; Manufacturer: Xilinx; Package Information: Latest Revision: ver1.0, May-2003; Class I: Memory; Code - JEDEC: MO-153-AC; Fitted: True; Published: 20-Aug-2003; Datasheet: Latest Revision: ver1.1, June-2003; Package Reference: VO20; Publisher: Altium Limited; Class II: PROM
U7 = XC2S300E-6PQ208C: Spartan-IIE 1.8V FPGA, 208-Pin PQFP, Standard Performance, Commercial Grade; Package Information: Latest Revision: ver1.1, Oct-2002; Code - JEDEC: MS-029-FA-1; Published: 19-Jul-2002; Revision: 17-Sep-2003: Pin names updated to match datasheet, ver2.1.; Datasheet: Latest Revision: 09-Jul-2003; Package Reference: PQ208; Publisher: Altium Limited

## Sheet PCB_Power.SchDoc
size A4; DocumentNumber: 5; SheetNumber: 5; SheetTotal: 8
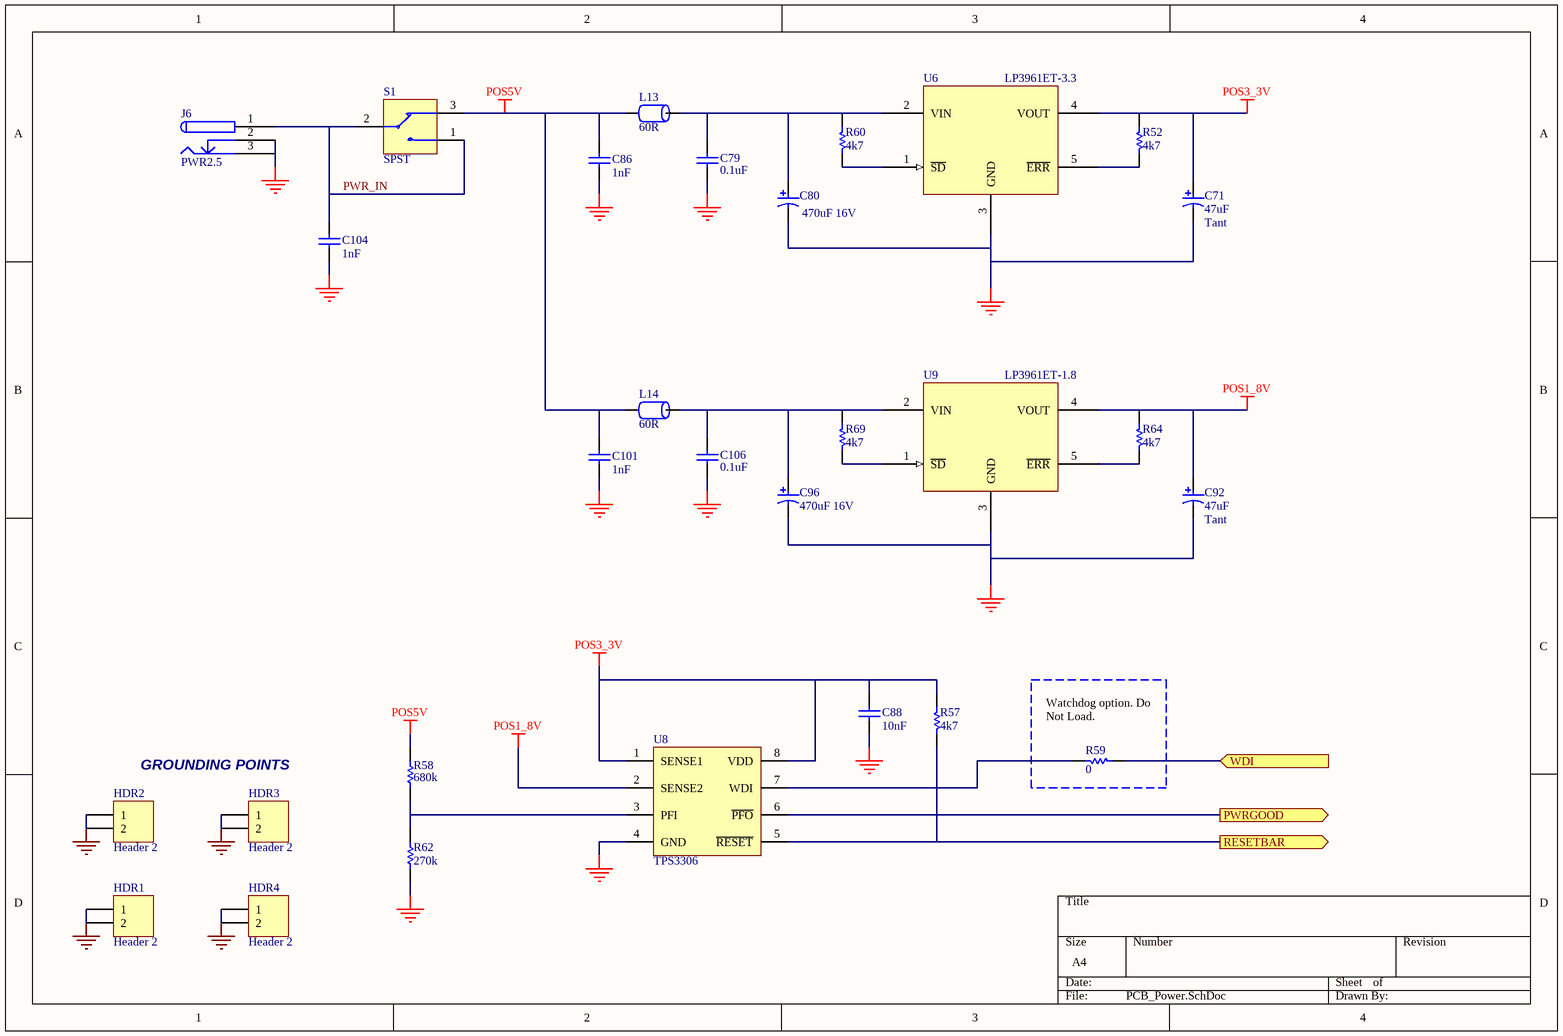
[diagram p7: PCB_Power.SchDoc]

### Parts
C71  47uF  Capacitor Type: Tant  [MCCTD]
C79  0.1uF  [CC2012-0805]
C80  470uF 16V  [RB8/3.5]
C86  1nF  [CC2012-0805]
C88  10nF  [CC2012-0805]
C92  47uF  Capacitor Type: Tant  [MCCTD]
C96  470uF 16V  [RB8/3.5]
C101  1nF  [CC2012-0805]
C104  1nF  [CC2012-0805]
C106  0.1uF  [CC2012-0805]
HDR1  Header 2  [HDR1X2]
HDR2  Header 2  [HDR1X2]
HDR3  Header 2  [HDR1X2]
HDR4  Header 2  [HDR1X2]
J6  PWR2.5  [PWR2.5]
L13  60R  [CC2012-0805]
L14  60R  [CC2012-0805]
R52  4k7  [CC2012-0805]
R57  4k7  [CC2012-0805]
R58  680k  [CC2012-0805]
R59  0  [CC2012-0805]
R60  4k7  [CC2012-0805]
R62  270k  [CC2012-0805]
R64  4k7  [CC2012-0805]
R69  4k7  [CC2012-0805]
S1  SPST  [PCB_SWITCH]
U6  LP3961ET-3.3  [TO220-5V]
U8  TPS3306  [SOIC8]
U9  LP3961ET-1.8  [TO220-5V]

### Ports
PWRGOOD (out), RESETBAR (out), WDI (in)

### Nets
GND: C71.2 C79.2 C80.2 C86.2 C88.2 C92.2 C96.2 C101.2 C104.2 C106.2 HDR1.1 HDR1.2 HDR2.1 HDR2.2 HDR3.1 HDR3.2 HDR4.1 HDR4.2 J6.2 J6.3 R62.2 U6.3(GND) U8.4(GND) U9.3(GND)
POS1_8V: C92.1 R64.2 U8.2(SENSE2) U9.4(VOUT)
POS3_3V: C71.1 C88.1 R52.2 R57.2 U6.4(VOUT) U8.1(SENSE1) U8.8(VDD)
POS5V: C86.1 C101.1 L13.1 L14.1 R58.1 S1.3
PWR_IN: C104.1 J6.1 S1.1 S1.2
PWRGOOD: U8.6(~{PFO}) ; port PWRGOOD
RESETBAR: R57.1 U8.5(~{RESET}) ; port RESETBAR
WDOG: R59.1 ; port WDI
NetC79_1: C79.1 C80.1 L13.2 R60.2 U6.2(VIN)
NetC96_1: C96.1 C106.1 L14.2 R69.2 U9.2(VIN)
NetR52_1: R52.1 U6.5(~{ERR})
NetR58_2: R58.2 R62.1 U8.3(PFI)
NetR59_2: R59.2 U8.7(WDI)
NetR60_1: R60.1 U6.1(~{SD})
NetR64_1: R64.1 U9.5(~{ERR})
NetR69_1: R69.1 U9.1(~{SD})

### Notes on the sheet
- GROUNDING POINTS
- (near R59) Watchdog option. Do Not Load.

### Library data of the parts
C71 C80 C92 C96 = CAP_POLAR: Polar Capacitor; Fitted: True
C79 C86 C88 C101 C104 C106 = CAP: Capacitor; Fitted: True
HDR1-HDR4 = Header 2: Header, 2-Pin; Manufacturer: Generic Components; Class I: Connector; Fitted: True; Revision: July-2002: Re-released for DXP Platform.; Publisher: Altium Limited
J6 = PWR2.5: Low Voltage Power Supply Sonnector; Fitted: True
L13 L14 = FERRITE_BEAD: BMB Series Ferrite Chip Bead
R52 R57-R60 R62 R64 R69 = RES: Resistor; Fitted: True
S1 = PCB_MOUNT_SWITCH: SPDT Subminiature Toggle Switch; Fitted: True
U6 U9 = LP3961ET: 800mA Fast UL Dropout Regulator
U8 = TPS3306: TI Dual Voltage MPU Supervisory Circuit

## Nets that join several sheets
GND: PCB_DecoderA (34 pins), PCB_DecoderB (33 pins), PCB_Headers (JP2.20 JP3.20 JP4.9 JP4.10), PCB_Encoder (34 pins), PCB_IO (13 pins), PCB_Controller (70 pins), PCB_Power (24 pins)
POS1_8V: PCB_Controller (C78.1 L12.1), PCB_Power (C92.1 R64.2 U8.2 U9.4)
POS3_3V: PCB_DecoderA (C11.1 C56.1 L2.1 L9.1), PCB_DecoderB (C10.1 C53.1 L1.1 L8.1), PCB_Encoder (C32.1 C69.1 L6.1 L10.1), PCB_IO (8 pins), PCB_Controller (C68.1 L11.1), PCB_Power (7 pins)
POS5V: PCB_IO (LED5.1), PCB_Power (6 pins)
AIN0: PCB_DecoderA (R8.1), PCB_DecoderB (R17.1), PCB_IO (J5.1)
AIN1: PCB_DecoderA (R6.1), PCB_DecoderB (R15.1), PCB_IO (J4.1)
AIN2: PCB_DecoderA (R4.1), PCB_DecoderB (R13.1), PCB_IO (J3.1)
AIN3: PCB_DecoderA (R2.1), PCB_DecoderB (R11.1), PCB_IO (J1.1)
CLKOUT: PCB_Headers (JP3.10), PCB_Encoder (R49.1 U3.4), PCB_Controller (U7.40 U7.81)
KEY0: PCB_IO (R78.2 SW4.3 SW4.4), PCB_Controller (U7.75)
KEY1: PCB_IO (R67.2 SW3.3 SW3.4), PCB_Controller (U7.74)
KEY2: PCB_IO (R63.2 SW2.3 SW2.4), PCB_Controller (U7.73)
KEY3: PCB_IO (R55.2 SW1.3 SW1.4), PCB_Controller (U7.71)
LED0: PCB_IO (R68.2), PCB_Controller (U7.63)
LED1: PCB_IO (R65.2), PCB_Controller (U7.62)
LED2: PCB_IO (R56.2), PCB_Controller (U7.61)
LED3: PCB_IO (R53.2), PCB_Controller (U7.60)
LLCA: PCB_DecoderA (R21.1), PCB_Headers (JP2.10), PCB_Controller (U7.80 U7.112 U7.182)
LLCB: PCB_DecoderB (R22.1), PCB_Headers (JP2.19), PCB_Controller (U7.125 U7.185)
MPA0: PCB_DecoderA (R30.1), PCB_Headers (JP2.2), PCB_Controller (U7.111)
MPA1: PCB_DecoderA (R40.1), PCB_Headers (JP2.3), PCB_Controller (U7.110)
MPA2: PCB_DecoderA (R31.1), PCB_Headers (JP2.4), PCB_Controller (U7.109)
MPA3: PCB_DecoderA (R41.1), PCB_Headers (JP2.5), PCB_Controller (U7.108)
MPA4: PCB_DecoderA (R32.1), PCB_Headers (JP2.6), PCB_Controller (U7.102)
MPA5: PCB_DecoderA (R42.1), PCB_Headers (JP2.7), PCB_Controller (U7.101)
MPA6: PCB_DecoderA (R33.1), PCB_Headers (JP2.8), PCB_Controller (U7.100)
MPA7: PCB_DecoderA (R43.1), PCB_Headers (JP2.9), PCB_Controller (U7.99)
MPB0: PCB_DecoderB (R35.1), PCB_Headers (JP2.11), PCB_Controller (U7.113)
MPB1: PCB_DecoderB (R36.1), PCB_Headers (JP2.12), PCB_Controller (U7.114)
MPB2: PCB_DecoderB (R37.1), PCB_Headers (JP2.13), PCB_Controller (U7.115)
MPB3: PCB_DecoderB (R44.1), PCB_Headers (JP2.14), PCB_Controller (U7.116)
MPB4: PCB_DecoderB (R38.1), PCB_Headers (JP2.15), PCB_Controller (U7.120)
MPB5: PCB_DecoderB (R45.1), PCB_Headers (JP2.16), PCB_Controller (U7.121)
MPB6: PCB_DecoderB (R39.1), PCB_Headers (JP2.17), PCB_Controller (U7.122)
MPB7: PCB_DecoderB (R46.1), PCB_Headers (JP2.18), PCB_Controller (U7.123)
MPOUT0: PCB_Headers (JP3.2), PCB_Encoder (U3.16), PCB_Controller (U7.126)
MPOUT1: PCB_Headers (JP3.3), PCB_Encoder (U3.15), PCB_Controller (U7.55)
MPOUT2: PCB_Headers (JP3.4), PCB_Encoder (U3.14), PCB_Controller (U7.30)
MPOUT3: PCB_Headers (JP3.5), PCB_Encoder (U3.13), PCB_Controller (U7.31)
MPOUT4: PCB_Headers (JP3.6), PCB_Encoder (U3.12), PCB_Controller (U7.33)
MPOUT5: PCB_Headers (JP3.7), PCB_Encoder (U3.11), PCB_Controller (U7.34)
MPOUT6: PCB_Headers (JP3.8), PCB_Encoder (U3.10), PCB_Controller (U7.35)
MPOUT7: PCB_Headers (JP3.9), PCB_Encoder (U3.9), PCB_Controller (U7.36)
PWRGOOD: PCB_Controller (U7.140), PCB_Power (U8.6)
RCV1: PCB_Headers (JP3.15), PCB_Encoder (U3.7), PCB_Controller (U7.47)
RCV2: PCB_Headers (JP3.16), PCB_Encoder (U3.8), PCB_Controller (U7.46)
RESETBAR: PCB_DecoderA (U1.24 U1.58), PCB_DecoderB (U2.24 U2.58), PCB_Headers (JP3.17), PCB_Encoder (U3.40), PCB_Controller (U7.45 U7.77), PCB_Power (R57.1 U8.5)
RTSA0: PCB_DecoderA (U1.28), PCB_Headers (JP3.11), PCB_Controller (U7.41)
RTSA1: PCB_DecoderA (U1.29), PCB_Headers (JP3.12), PCB_Controller (U7.42)
RTSB0: PCB_DecoderB (U2.28), PCB_Headers (JP3.13), PCB_Controller (U7.49)
RTSB1: PCB_DecoderB (U2.29), PCB_Headers (JP3.14), PCB_Controller (U7.48)
SCL: PCB_DecoderA (U1.63), PCB_DecoderB (U2.63), PCB_Headers (JP3.19), PCB_Encoder (R47.1 U3.41), PCB_Controller (U7.43)
SDA: PCB_DecoderA (U1.62), PCB_DecoderB (U2.62), PCB_Headers (JP3.18), PCB_Encoder (R48.1 U3.42), PCB_Controller (U7.44)
TCK: PCB_Top (R54.2), PCB_DecoderA (U1.59), PCB_DecoderB (U2.59)
TCK_HARD: PCB_Top (R54.1), PCB_Headers (JP4.3), PCB_Controller (U5.6 U7.207)
TCK_SOFT: PCB_Headers (JP4.7), PCB_Controller (U7.10)
TDI_B: PCB_DecoderA (R19.1 R20.2), PCB_DecoderB (R10.1 U2.3)
TDI_HARD: PCB_Headers (JP4.1), PCB_Controller (R50.1 U7.159)
TDI_SOFT: PCB_Headers (JP4.5), PCB_Controller (R61.1 U7.11)
TDO_CONTROLLER: PCB_DecoderA (R20.1 U1.3), PCB_Controller (R50.2 U5.17)
TDO_HARD: PCB_DecoderB (R10.2 R18.1), PCB_Headers (JP4.2)
TDO_SOFT: PCB_Headers (R66.1), PCB_Controller (R61.2 U7.21)
TMS: PCB_Top (R51.2), PCB_DecoderA (U1.4), PCB_DecoderB (U2.4)
TMS_HARD: PCB_Top (R51.1), PCB_Headers (JP4.4), PCB_Controller (U5.5 U7.2)
TMS_SOFT: PCB_Headers (JP4.8), PCB_Controller (U7.9)
WDOG: PCB_Controller (U7.139), PCB_Power (R59.1)